# EasyEDA Pro project Backlit-PCB-Art-Lamp.epro

# Schematic Electrical Schematic

## Sheets
1 Power & Control: Create Date: 2026-09-15; Page Name: P1; Project Name: PCB Backlight Art Light; Schematic Name: Schematic1; Update Date: 2026-09-15; Company: Personal Project; Drawed: Junyi Wu; Page Size: A4; Version: 2.3
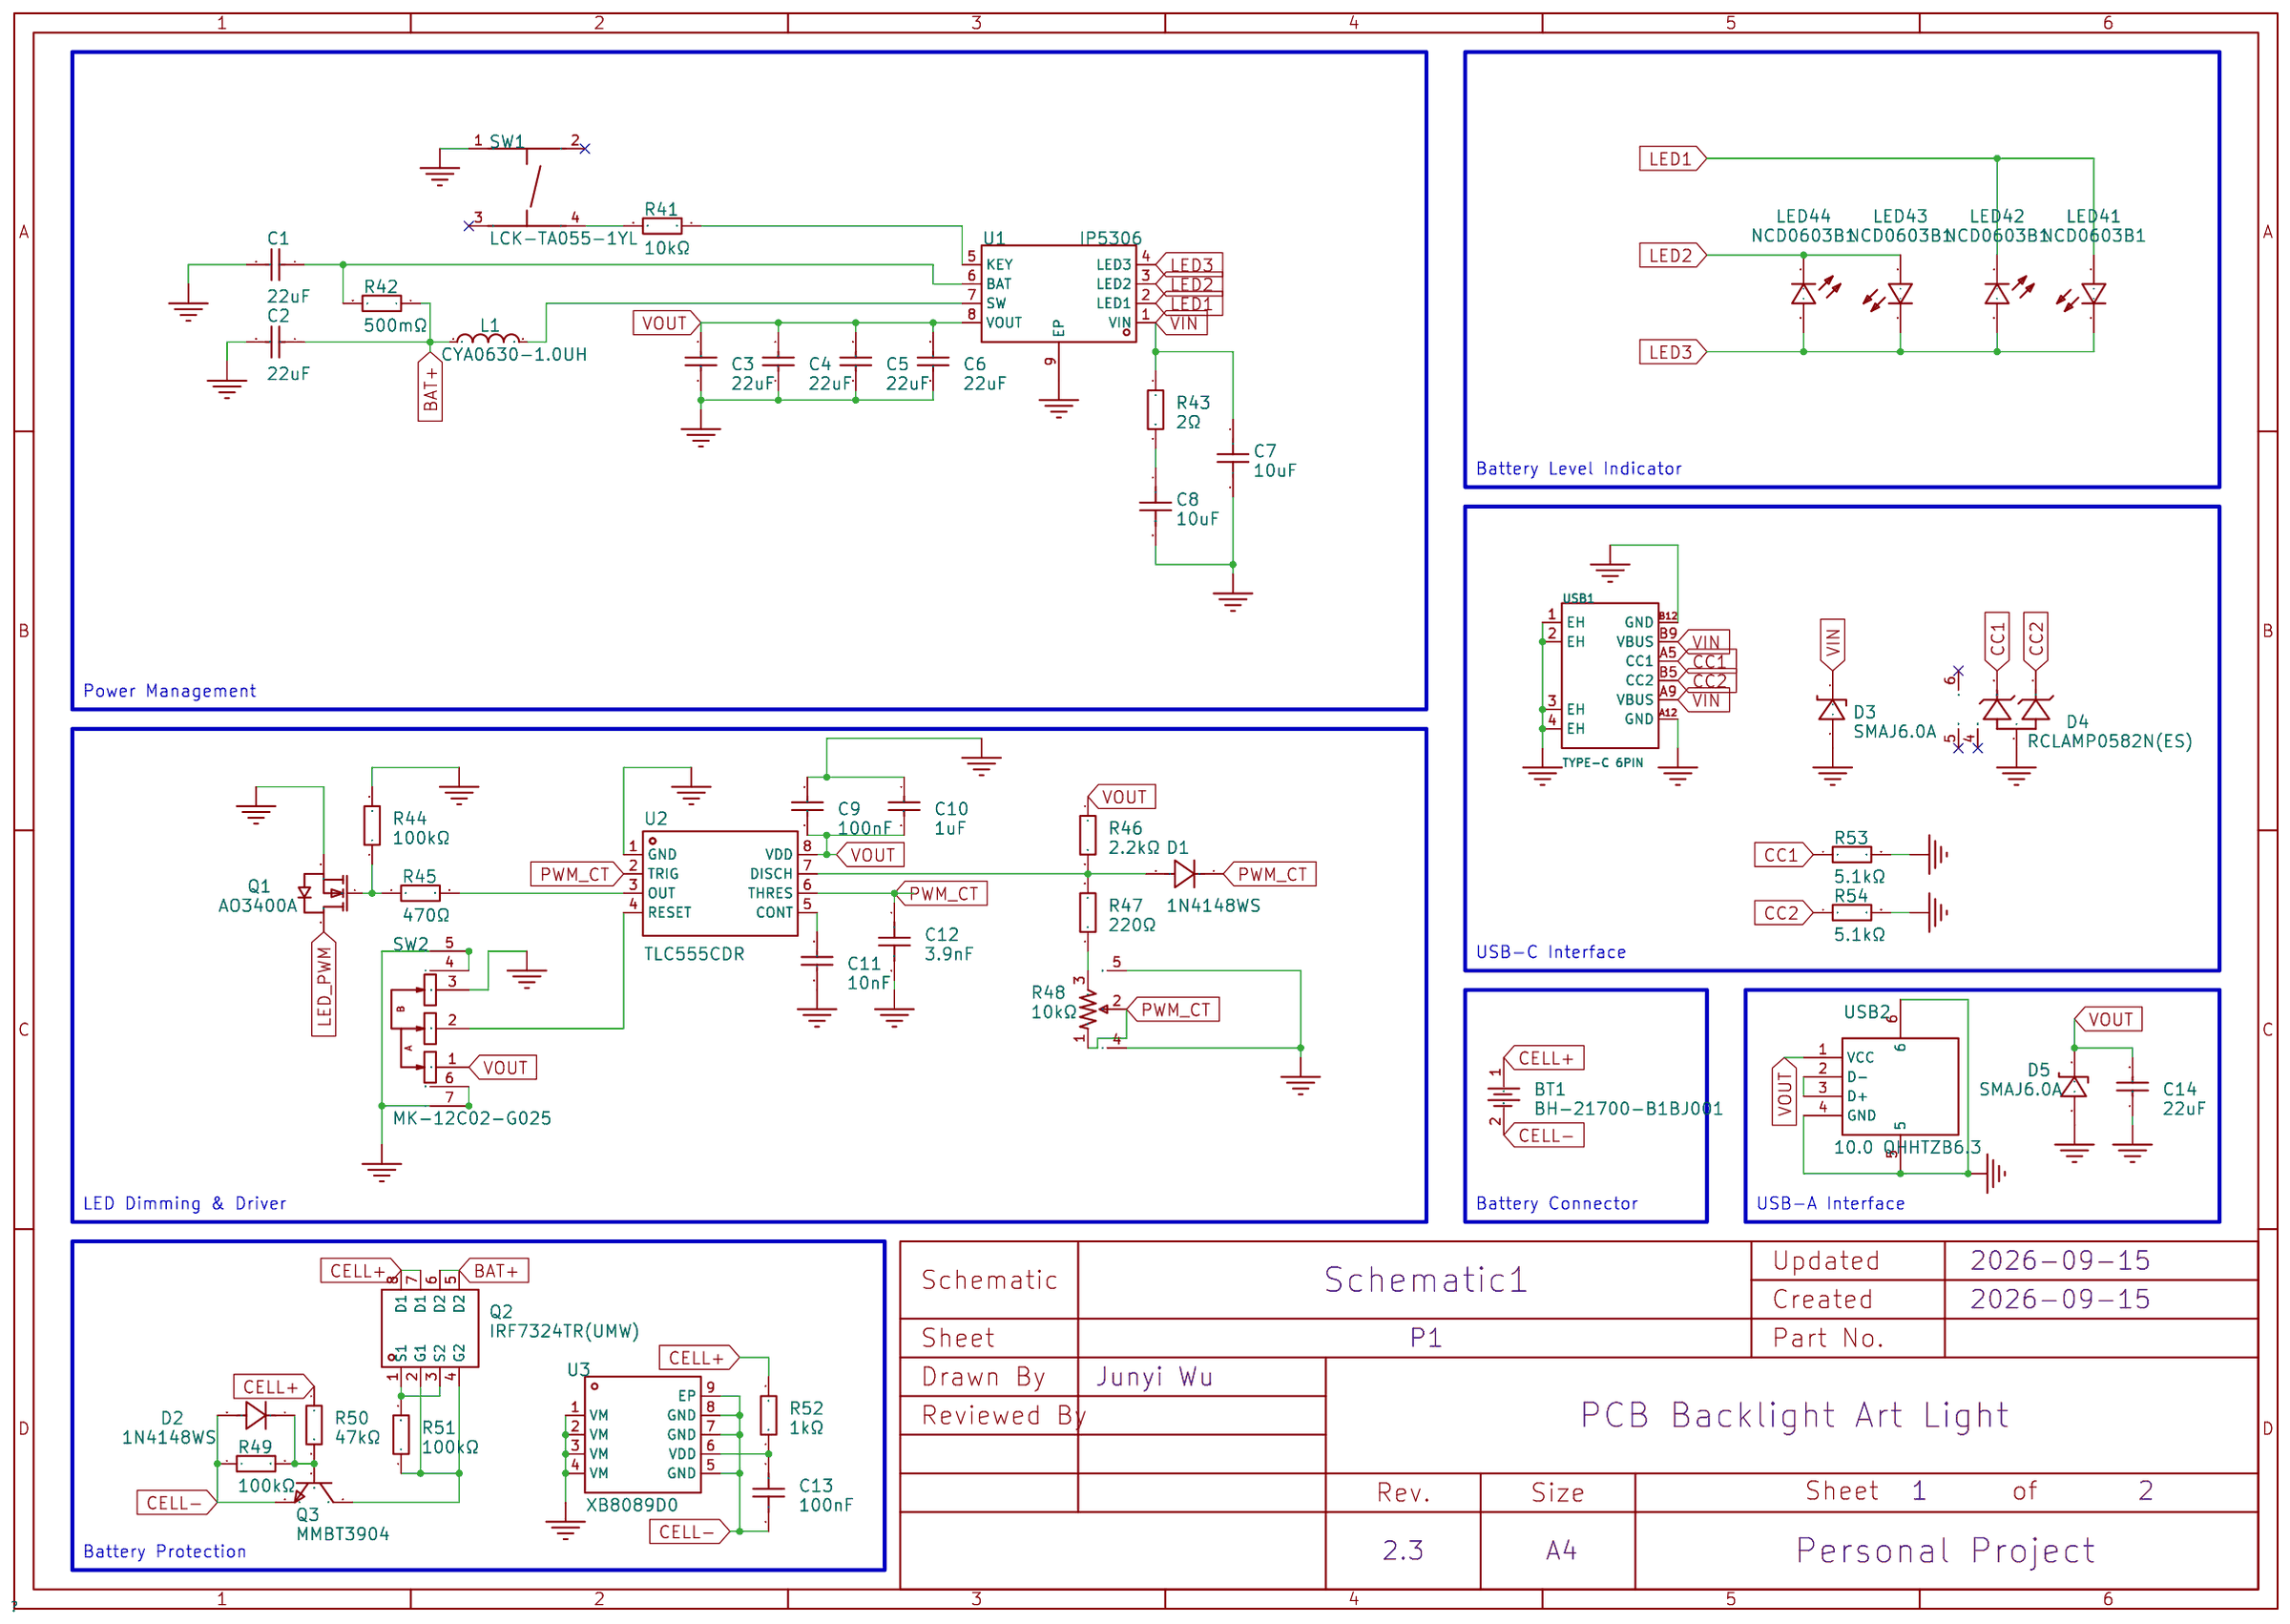
[diagram p0: Power & Control]
2 LED Array: Page Name: P2
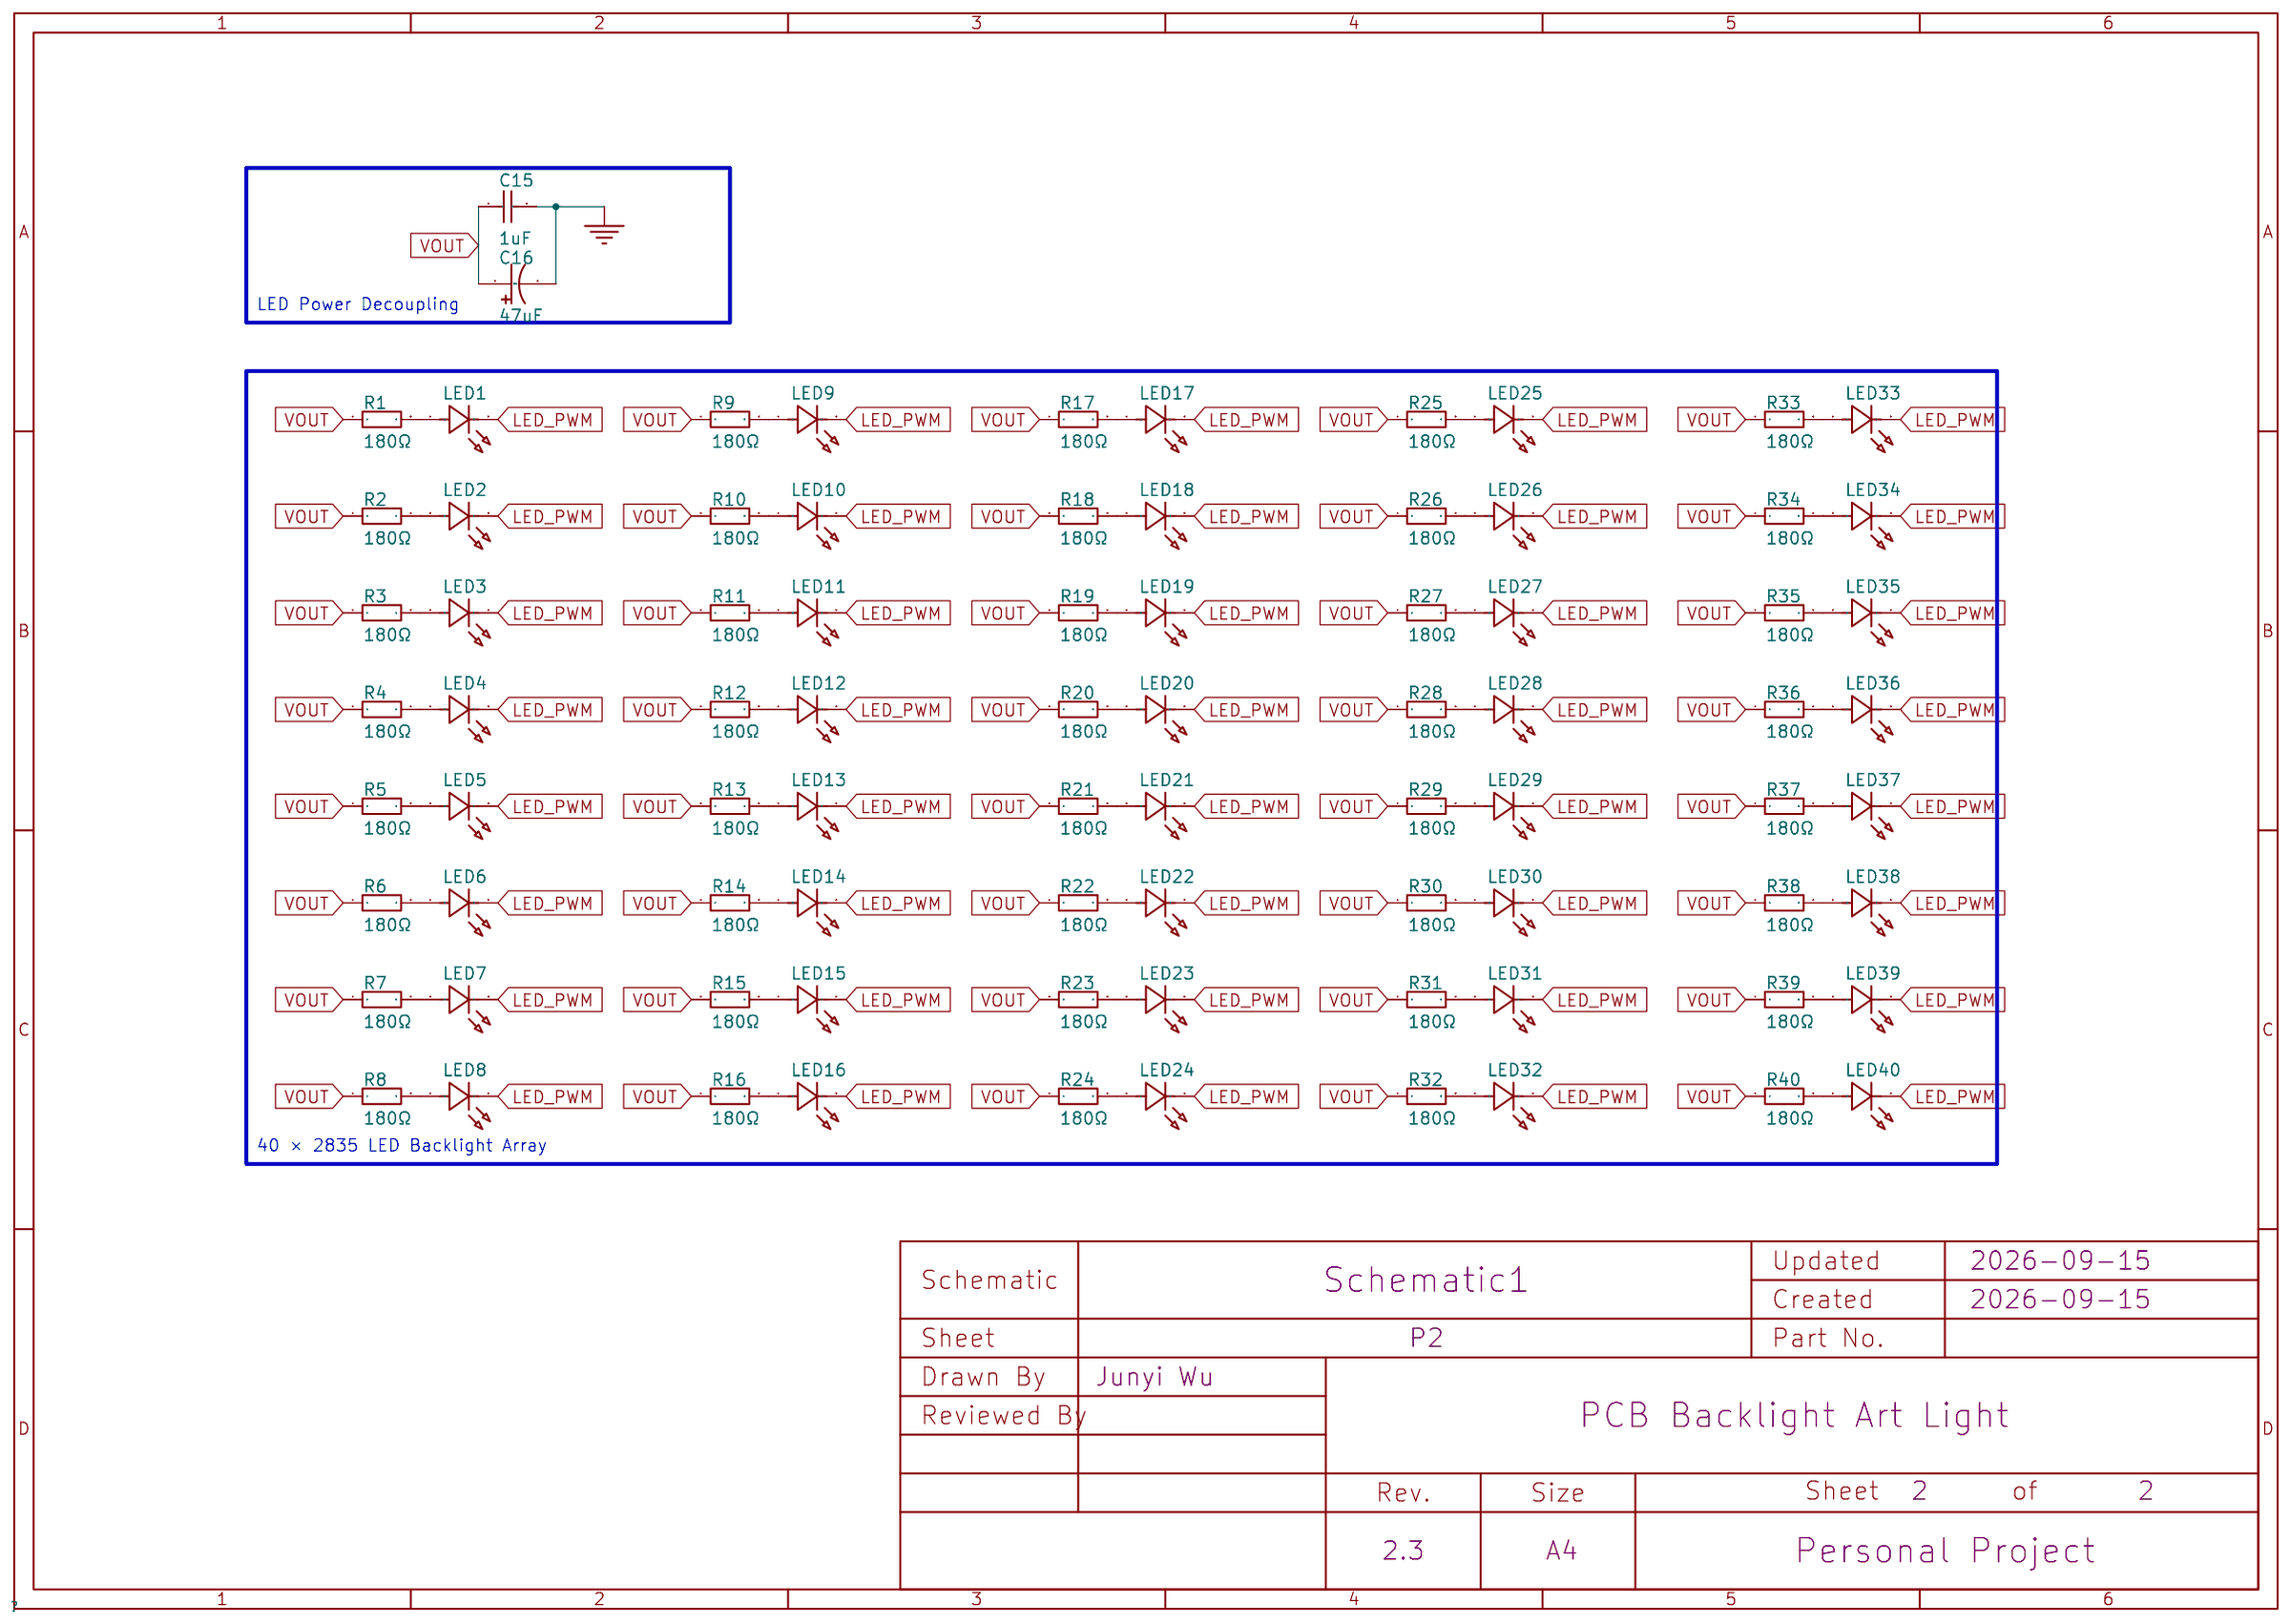
[diagram p1: LED Array]

## Parts
sheet LED Array
C15  1uF  [C0603]
C16  47uF  [CAP-SMD_BD5.0-L5.3-W5.3-LS6.5-FD-1]
LED1  -  [RCW_2835_LED_Custom]
LED2  -  [RCW_2835_LED_Custom]
LED3  -  [RCW_2835_LED_Custom]
LED4  -  [RCW_2835_LED_Custom]
LED5  -  [RCW_2835_LED_Custom]
LED6  -  [RCW_2835_LED_Custom]
LED7  -  [RCW_2835_LED_Custom]
LED8  -  [RCW_2835_LED_Custom]
LED9  -  [RCW_2835_LED_Custom]
LED10  -  [RCW_2835_LED_Custom]
LED11  -  [RCW_2835_LED_Custom]
LED12  -  [RCW_2835_LED_Custom]
LED13  -  [RCW_2835_LED_Custom]
LED14  -  [RCW_2835_LED_Custom]
LED15  -  [RCW_2835_LED_Custom]
LED16  -  [RCW_2835_LED_Custom]
LED17  -  [RCW_2835_LED_Custom]
LED18  -  [RCW_2835_LED_Custom]
LED19  -  [RCW_2835_LED_Custom]
LED20  -  [RCW_2835_LED_Custom]
LED21  -  [RCW_2835_LED_Custom]
LED22  -  [RCW_2835_LED_Custom]
LED23  -  [RCW_2835_LED_Custom]
LED24  -  [RCW_2835_LED_Custom]
LED25  -  [RCW_2835_LED_Custom]
LED26  -  [RCW_2835_LED_Custom]
LED27  -  [RCW_2835_LED_Custom]
LED28  -  [RCW_2835_LED_Custom]
LED29  -  [RCW_2835_LED_Custom]
LED30  -  [RCW_2835_LED_Custom]
LED31  -  [RCW_2835_LED_Custom]
LED32  -  [RCW_2835_LED_Custom]
LED33  -  [RCW_2835_LED_Custom]
LED34  -  [RCW_2835_LED_Custom]
LED35  -  [RCW_2835_LED_Custom]
LED36  -  [RCW_2835_LED_Custom]
LED37  -  [RCW_2835_LED_Custom]
LED38  -  [RCW_2835_LED_Custom]
LED39  -  [RCW_2835_LED_Custom]
LED40  -  [RCW_2835_LED_Custom]
R1  180Ω  [R0603]
R2  180Ω  [R0603]
R3  180Ω  [R0603]
R4  180Ω  [R0603]
R5  180Ω  [R0603]
R6  180Ω  [R0603]
R7  180Ω  [R0603]
R8  180Ω  [R0603]
R9  180Ω  [R0603]
R10  180Ω  [R0603]
R11  180Ω  [R0603]
R12  180Ω  [R0603]
R13  180Ω  [R0603]
R14  180Ω  [R0603]
R15  180Ω  [R0603]
R16  180Ω  [R0603]
R17  180Ω  [R0603]
R18  180Ω  [R0603]
R19  180Ω  [R0603]
R20  180Ω  [R0603]
R21  180Ω  [R0603]
R22  180Ω  [R0603]
R23  180Ω  [R0603]
R24  180Ω  [R0603]
R25  180Ω  [R0603]
R26  180Ω  [R0603]
R27  180Ω  [R0603]
R28  180Ω  [R0603]
R29  180Ω  [R0603]
R30  180Ω  [R0603]
R31  180Ω  [R0603]
R32  180Ω  [R0603]
R33  180Ω  [R0603]
R34  180Ω  [R0603]
R35  180Ω  [R0603]
R36  180Ω  [R0603]
R37  180Ω  [R0603]
R38  180Ω  [R0603]
R39  180Ω  [R0603]
R40  180Ω  [R0603]
sheet Power & Control
BT1  BH-21700-B1BJ001  [BAT-SMD_L82.5.5-W25-BH-21700-B1BJ001]
C1  22uF  [C1206]
C2  22uF  [C1206]
C3  22uF  [C1206]
C4  22uF  [C1206]
C5  22uF  [C1206]
C6  22uF  [C1206]
C7  10uF  [C0603]
C8  10uF  [C0603]
C9  100nF  [C0603]
C10  1uF  [C0603]
C11  10nF  [C0603]
C12  3.9nF  [C0603]
C13  100nF  [C0603]
C14  22uF  [C1206]
D1  1N4148WS  [SOD-323_L1.8-W1.3-LS2.5-RD]
D2  1N4148WS  [SOD-323_L1.8-W1.3-LS2.5-RD]
D3  SMAJ6.0A  [SMA_L4.3-W2.6-LS5.1-RD]
D4  RCLAMP0582N(ES)  [DFN1210-6_L1.2-W1.0-P0.40-BL]
D5  SMAJ6.0A  [SMA_L4.3-W2.6-LS5.1-RD]
L1  CYA0630-1.0UH  [IND-SMD_L7.2-W6.6_GPSR0730]
LED41  NCD0603B1  [LED0603-RD]
LED42  NCD0603B1  [LED0603-RD]
LED43  NCD0603B1  [LED0603-RD]
LED44  NCD0603B1  [LED0603-RD]
Q1  AO3400A  [SOT-23-3_L2.9-W1.3-P1.90-LS2.4-BR]
Q2  IRF7324TR(UMW)  [SOP-8_L4.9-W3.9-P1.27-LS6.0-BL]
Q3  MMBT3904  [SOT-23-3_L2.9-W1.3-P1.90-LS2.4-BR]
R41  10kΩ  [R0603]
R42  500mΩ  [R0603]
R43  2Ω  [R0603]
R44  100kΩ  [R0603]
R45  470Ω  [R0603]
R46  2.2kΩ  [R0603]
R47  220Ω  [R0603]
R48  10kΩ  [RISYM_B103_3Pin_Custom]
R49  100kΩ  [R0603]
R50  47kΩ  [R0603]
R51  100kΩ  [R0603]
R52  1kΩ  [R0603]
R53  5.1kΩ  [R0603]
R54  5.1kΩ  [R0603]
SW1  LCK-TA055-1YL  [KEY-SMD_4P-L4.7-W3.6_LCK-TA055-1YL]
SW2  MK-12C02-G025  [SW-SMD_MK-12C02-G025]
U1  IP5306  [ESOP-8_L4.9-W3.9-P1.27-LS6.0-BL-EP]
U2  TLC555CDR  [SOIC-8_L5.0-W4.0-P1.27-LS6.0-BL]
U3  XB8089D0  [SOIC-8_L4.9-W3.9-P1.27-LS6.0-BL-EP3.3-1]
USB1  TYPE-C 6PIN  [USB-SMD_TYPE-C-6PIN]
USB2  10.0 QHHTZB6.3  [USB-A-TH_10.0QHHTZB6.3]

## Library data of the parts
C10 C15 = CC0603KRX5R8BB105: 容值:1uF;精度:±10%;额定电压:25V;温度系数:X5R;; LCSC Part Name: 1uF ±10% 25V; Supplier Part: C14664; Manufacturer: YAGEO(国巨); Supplier Footprint: 0603; JLCPCB Part Class: Extended Part; Datasheet: https://item.szlcsc.com/datasheet/CC0603KRX5R8BB105/15332.html; Supplier: LCSC; Tolerance: ±10%; Voltage Rating: 25V; Temperature Coefficient: X5R
C16 = EEEFK1C470UR: 容值:47uF;精度:±20%;额定电压:16V;纹波电流:120mA@120Hz;等效串联电阻(ESR):-;; LCSC Part Name: 47uF ±20% 16V; Supplier Part: C178535; Manufacturer: PANASONIC(松下); Supplier Footprint: SMD; JLCPCB Part Class: Extended Part; Datasheet: https://item.szlcsc.com/datasheet/EEEFK1C470UR/189928.html; Supplier: LCSC; Tolerance: ±20%; Voltage Rating: 16V; Ripple Current: 120mA@120Hz; Lifetime: 2000hrs@105℃; Operating Temperature: -55℃~+105℃; Polarity type: 有极性
LED1-LED40 = RCW_2835_LED: 灯头类型:-;发光颜色:暖白色;正向压降(Vf):3.4V;功率:200mW;正向电流:60mA;波长:-;二极管配置:独立二极管;透镜颜色:雾状黄色透镜;色温:3000K~3200K;发光强度:-;发光角度:120°;载带方式:-;工作温度:-30℃~+85℃;; Manufacturer: RCW; Supplier Footprint: SMD2835; Illumination Color: 白色; Voltage - Forward(Vf): 3.4V; Power(Watts): 500mW; Forward Current: 150mA; Diode Configuration: 独立二极管; Color Temperature: 4500K; Operating Temperature: -30℃~+85℃
R1-R40 = 0603WAF1800T5E: 电阻类型:厚膜电阻;阻值:180Ω;精度:±1%;功率:100mW;最大工作电压:75V;温度系数:±100ppm/℃;; LCSC Part Name: 180Ω ±1% 100mW 厚膜电阻; Supplier Part: C22828; Manufacturer: UNI-ROYAL(厚声); Supplier Footprint: 0603; JLCPCB Part Class: Extended Part; Datasheet: https://atta.szlcsc.com/upload/public/pdf/source/20200306/C422600_1E6D84923E4A46A82E41ADD87F860B5C.pdf; Supplier: LCSC; Type: 厚膜电阻; Tolerance: ±1%; Power(Watts): 100mW; Overload Voltage (Max): 75V; Temperature Coefficient: ±100ppm/℃; Operating Temperature Range: -55℃~+155℃
BT1 = BH-21700-B1BJ001: 电池盒BHNi SMT 适用电池型号21700电池/电芯/ SMT贴片工艺 材质：锰钢  镀镍，; LCSC Part Name: MYOUNG(美阳)电池盒BH-21700-1J Ni SMT贴片工艺 适配21700电池; Supplier Part: C20606791; Manufacturer: MYOUNG(美阳); JLCPCB Part Class: Extended Part; Datasheet: https://item.szlcsc.com/datasheet/BH-21700-B1BJ001/21949508.html; Supplier: LCSC; Type: 电池盒; Operating Temperature: -25~85℃; Contact coating: 镀镍
C1-C6 C14 = CL31A226KAHNNNE: 容值:22uF;精度:±10%;额定电压:25V;温度系数:X5R;; LCSC Part Name: 22uF ±10% 25V; Supplier Part: C12891; Manufacturer: SAMSUNG(三星); Supplier Footprint: 1206; JLCPCB Part Class: 基础库; Datasheet: https://item.szlcsc.com/datasheet/CL31A226KAHNNNE/13537.html; Supplier: LCSC; Tolerance: ±10%; Voltage Rating: 25V; Temperature Coefficient: X5R
C7 C8 = CL10A106MA8NRNC: 容值:10uF;精度:±20%;额定电压:25V;温度系数:X5R;; LCSC Part Name: 10uF ±20% 25V; Supplier Part: C96446; Manufacturer: SAMSUNG(三星); Supplier Footprint: 0603; JLCPCB Part Class: Basic Part; Datasheet: https://item.szlcsc.com/datasheet/CL10A106MA8NRNC/97651.html; Supplier: LCSC; Tolerance: ±20%; Voltage Rating: 25V; Temperature Coefficient: X5R
C9 = CL10B104KO8NNNC: 容值:100nF;精度:±10%;额定电压:16V;温度系数:X7R;; LCSC Part Name: 100nF ±10% 16V; Supplier Part: C66501; Manufacturer: SAMSUNG(三星); Supplier Footprint: 0603; JLCPCB Part Class: Extended Part; Datasheet: https://item.szlcsc.com/datasheet/CL10B104KO8NNNC/67585.html; Supplier: LCSC; Tolerance: ±10%; Voltage Rating: 16V; Temperature Coefficient: X7R
C11 = CC0603JRX7R9BB103: 容值:10nF;精度:±5%;额定电压:50V;温度系数:X7R;; LCSC Part Name: 10nF ±5% 50V; Supplier Part: C115056; Manufacturer: YAGEO(国巨); Supplier Footprint: 0603; JLCPCB Part Class: Extended Part; Datasheet: https://item.szlcsc.com/datasheet/CC0603JRX7R9BB103/116301.html; Supplier: LCSC; Tolerance: ±5%; Voltage Rating: 50V; Temperature Coefficient: X7R
C12 = GRM1885C1H392JA01D: 容值:3.9nF;精度:±5%;额定电压:50V;温度系数:C0G;; LCSC Part Name: 3.9nF ±5% 50V; Supplier Part: C415537; Manufacturer: muRata(村田); Supplier Footprint: 0603; JLCPCB Part Class: Extended Part; Datasheet: https://item.szlcsc.com/datasheet/GRM1885C1H392JA01D/408031.html; Supplier: LCSC; Tolerance: ±5%; Voltage Rating: 50V; Temperature Coefficient: C0G
C13 = CC0603KRX7R9BB104: 容值:100nF;精度:±10%;额定电压:50V;温度系数:X7R;; LCSC Part Name: 100nF ±10% 50V; Supplier Part: C14663; Manufacturer: YAGEO(国巨); Supplier Footprint: 0603; JLCPCB Part Class: 基础库; Datasheet: https://item.szlcsc.com/datasheet/CC0603KRX7R9BB104/15331.html; Supplier: LCSC; Tolerance: ±10%; Voltage Rating: 50V; Temperature Coefficient: X7R
D1 D2 = 1N4148WS_C917117: 二极管配置:独立式;整流电流:200mA;直流反向耐压(Vr):75V;正向压降(Vf):1.25V@150mA;反向恢复时间(Trr):4ns;; LCSC Part Name: 75V 200mA; Supplier Part: C917117; Manufacturer: JSMSEMI(杰盛微); Supplier Footprint: SOD-323; JLCPCB Part Class: Extended Part; Datasheet: https://item.szlcsc.com/datasheet/1N4148WS/991613.html; Supplier: LCSC; Diode Configuration: 独立式; Pd - Power Dissipation: 200mW; Current - Rectified: 200mA; Voltage - DC Reverse(Vr): 75V; Voltage - Forward(Vf@If): 1.25V@150mA; Non-Repetitive Peak Forward Surge Current: 2A; Reverse Leakage Current (Ir): 1uA@75V; Reverse Recovery Time (trr): 4ns; Operating Junction Temperature Range: -55℃~+150℃
D3 D5 = SMAJ6.0A_C364284: 极性:单向;反向截止电压(Vrwm):6V;钳位电压:10.3V;峰值脉冲电流(Ipp):38.8A;峰值脉冲功率(Ppp):400W@10/1000us;击穿电压(VBR):7.37V;; LCSC Part Name: 单向TVS 6V截止 峰值脉冲电流：38.8A; Supplier Part: C364284; Manufacturer: MDD(辰达半导体); Supplier Footprint: DO-214AC(SMA); JLCPCB Part Class: Extended Part; Datasheet: https://item.szlcsc.com/datasheet/SMAJ6.0A/338596.html; Supplier: LCSC; Polarity: 单向; Reverse Stand-Off Voltage (Vrwm): 6V; Clamping Voltage: 10.3V; Peak Pulse Current (Ipp): 38.8A; Peak Pulse Power Dissipation (Ppp): 400W@10/1000us; Voltage - Breakdown: 7.37V; Reverse Leakage Current (Ir): 800uA; Number of Channels: 单路; Operating Temperature: -65℃~+150℃; level of protection: IEC 61000-4-2; Type: TVS
D4 = RCLAMP0582N(ES): 极性:单向;反向截止电压(Vrwm):5V;钳位电压:13V;峰值脉冲电流(Ipp):4A@8/20us;峰值脉冲功率(Ppp):60W@8/20us;击穿电压:6V;; LCSC Part Name: 极性：单向 2路保护 反向关断电压（典型值）:5V(Max) 击穿电压（最小值）:6V 箝位电压:8.5V 峰值脉冲电流:4.5A (8/20us) 极性:Unidirectional，电容Cj：0.6pF; Supplier Part: C46970803; Manufacturer: ElecSuper(静芯); Supplier Footprint: DFN1210-6L; JLCPCB Part Class: Extended Part; Datasheet: https://item.szlcsc.com/datasheet/RCLAMP0582N(ES)/49147983.html; Supplier: LCSC; Polarity: 单向; Reverse Stand-Off Voltage (Vrwm): 5V; Clamping Voltage: 13V; Peak Pulse Current (Ipp): 4A@8/20us; Peak Pulse Power Dissipation (Ppp): 60W@8/20us; Voltage - Breakdown: 6V; Reverse Leakage Current (Ir): 1uA; Number of Channels: 双路; Operating Temperature: -40℃~+125℃; level of protection: IEC 61000-4-2; Type: TVS; Junction Capacitance: 0.5pF
L1 = CYA0630-1.0UH: 大电流/屏蔽电感/一体成型电感; LCSC Part Name: 1uH ±20%; Supplier Part: C5189744; Manufacturer: SHOU HAN(首韩); Supplier Footprint: SMD,7.2x6.6mm; JLCPCB Part Class: Extended Part; Datasheet: https://item.szlcsc.com/datasheet/CYA0630-1.0UH/5869563.html; Supplier: LCSC
LED41-LED44 = NCD0603B1: 灯头类型:-;发光颜色:蓝色;正向压降(Vf):2.6V~3.6V;功率:72mW;测试电流:10mA;波长:463nm~475nm;二极管配置:独立二极管;透镜颜色:-;色温:-;发光强度:220mcd;发光角度:130°;载带方式:-;工作温度:-30℃~+85℃;; LCSC Part Name: 片式发光二极管; Supplier Part: C84266; Manufacturer: 国星光电; Supplier Footprint: 0603; JLCPCB Part Class: Extended Part; Datasheet: https://item.szlcsc.com/datasheet/NCD0603B1/85435.html; Supplier: LCSC; Illumination Color: 蓝色; Voltage - Forward(Vf): 2.6V~3.6V; Power(Watts): 72mW; Test Current: 10mA; Wavelength - Dominant: 463nm~475nm; Peak Wavelength: 465nm; Diode Configuration: 独立二极管; Luminous Intensity: 220mcd; Viewing Angle: 130°; Operating Temperature: -30℃~+85℃; Half wave width: 20nm
Q1 = AO3400A_C347475: 数量:1个N沟道;漏源电压(Vdss):30V;连续漏极电流(Id):5.8A;导通电阻(RDS(on)):17mΩ@10V;耗散功率(Pd):1.4W;阈值电压(Vgs(th)):1.1V;; LCSC Part Name: 1个N沟道 耐压:30V 电流:5.8A; Supplier Part: C347475; Manufacturer: UMW(友台半导体); Supplier Footprint: SOT-23; JLCPCB Part Class: Extended Part; Datasheet: https://item.szlcsc.com/datasheet/AO3400A/324135.html; Supplier: LCSC; Number: 1个N沟道; Drain to Source Voltage: 30V; Current - Continuous Drain(Id): 5.8A; RDS(on): 17mΩ@10V; Pd - Power Dissipation: 1.4W; Gate Threshold Voltage (Vgs(th)): 1.1V; Gate Charge(Qg): 9.7nC@4.5V; Input Capacitance(Ciss): 823pF; Reverse Transfer Capacitance (Crss@Vds): 77pF; Operating Temperature: -55℃~+150℃; Output Capacitance(Coss): 99pF
Q2 = IRF7324TR(UMW): 数量:2个P沟道;漏源电压(Vdss):20V;连续漏极电流(Id):9A;导通电阻(RDS(on)):18mΩ@4.5V;耗散功率(Pd):2W;阈值电压(Vgs(th)):1V;; LCSC Part Name: P沟道 耐压:20V 电流:9A; Supplier Part: C5447651; Manufacturer: UMW(友台半导体); Supplier Footprint: SOP-8; JLCPCB Part Class: Extended Part; Datasheet: https://item.szlcsc.com/datasheet/IRF7324TR(UMW)/6346569.html; Supplier: LCSC; Number: 2个P沟道; Drain to Source Voltage: 20V; Current - Continuous Drain(Id): 9A; RDS(on): 18mΩ@4.5V; Pd - Power Dissipation: 2W; Gate Threshold Voltage (Vgs(th)): 1V; Gate Charge(Qg): 42nC; Input Capacitance(Ciss): 2.94nF; Reverse Transfer Capacitance (Crss@Vds): 420pF; Operating Temperature: -55℃~+150℃; Type: P沟道; Output Capacitance(Coss): 630pF
Q3 = MMBT3904_C7420353: 晶体管类型:NPN;集电极电流(Ic):200mA;集射极击穿电压(Vceo):40V;耗散功率(Pd):200mW;直流电流增益(hFE):100;; LCSC Part Name: hFE:100-300，丝印:1AM NPN 电流:200mA 电压:40V; Supplier Part: C7420353; Manufacturer: R+O(宏嘉诚); Supplier Footprint: SOT-23; JLCPCB Part Class: Extended Part; Datasheet: https://item.szlcsc.com/datasheet/MMBT3904/8397175.html; Supplier: LCSC; type: NPN; Current - Collector(Ic): 200mA; Collector - Emitter Voltage VCEO: 40V; Pd - Power Dissipation: 200mW; DC Current Gain: 100; Transition frequency(fT): 300MHz; Current - Collector Cutoff: 100nA; Vce Saturation(VCE(sat)): 300mV; Operating Temperature: -55℃~+150℃; Emitter-Base Voltage(Vebo): 6V; Number: 1个NPN; Configuration: 独立式
R41 = 0603WAF1002T5E: 电阻类型:厚膜电阻;阻值:10kΩ;精度:±1%;功率:100mW;工作电压:75V;温度系数:±100ppm/℃;; LCSC Part Name: 厚膜电阻 10kΩ ±1% 100mW; Supplier Part: C25804; Manufacturer: UNI-ROYAL(厚声); Supplier Footprint: 0603; JLCPCB Part Class: 基础库; Datasheet: https://item.szlcsc.com/datasheet/0603WAF1002T5E/26547.html; Supplier: LCSC; Type: 厚膜电阻; Tolerance: ±1%; Power(Watts): 100mW; Voltage-Supply(Max): 75V; Temperature Coefficient: ±100ppm/℃; Operating Temperature: -55℃~+155℃
R42 = 0603WAF500LT5E: 电阻类型:厚膜电阻;阻值:500mΩ;精度:±1%;功率:100mW;工作电压:75V;温度系数:±800ppm/℃;; LCSC Part Name: 500mΩ ±1% 100mW 厚膜电阻; Supplier Part: C45312; Manufacturer: UNI-ROYAL(厚声); Supplier Footprint: 0603; JLCPCB Part Class: Extended Part; Datasheet: https://item.szlcsc.com/datasheet/0603WAF500LT5E/46314.html; Supplier: LCSC; Type: 厚膜电阻; Tolerance: ±1%; Power(Watts): 100mW; Voltage-Supply(Max): 75V; Temperature Coefficient: ±800ppm/℃; Operating Temperature: -55℃~+155℃
R43 = 0603WAF200KT5E: 电阻类型:厚膜电阻;阻值:2Ω;精度:±1%;功率:100mW;工作电压:75V;温度系数:±200ppm/℃;; LCSC Part Name: 2Ω ±1% 100mW 厚膜电阻; Supplier Part: C22977; Manufacturer: UNI-ROYAL(厚声); Supplier Footprint: 0603; JLCPCB Part Class: Basic Part; Datasheet: https://item.szlcsc.com/datasheet/0603WAF200KT5E/23704.html; Supplier: LCSC; Type: 厚膜电阻; Tolerance: ±1%; Power(Watts): 100mW; Voltage-Supply(Max): 75V; Temperature Coefficient: ±200ppm/℃; Operating Temperature: -55℃~+155℃
R44 R49 R51 = 0603WAF1003T5E: 电阻类型:厚膜电阻;阻值:100kΩ;精度:±1%;功率:100mW;工作电压:75V;温度系数:±100ppm/℃;; LCSC Part Name: 厚膜电阻 100kΩ ±1%; Supplier Part: C25803; Manufacturer: UNI-ROYAL(厚声); Supplier Footprint: 0603; JLCPCB Part Class: Basic Part; Datasheet: https://item.szlcsc.com/datasheet/0603WAF1003T5E/26546.html; Supplier: LCSC; Type: 厚膜电阻; Tolerance: ±1%; Power(Watts): 100mW; Voltage-Supply(Max): 75V; Temperature Coefficient: ±100ppm/℃; Operating Temperature: -55℃~+155℃
R45 = 0603WAF4700T5E: 电阻类型:厚膜电阻;阻值:470Ω;精度:±1%;功率:100mW;工作电压:75V;温度系数:±100ppm/℃;; LCSC Part Name: 厚膜电阻 470Ω ±1%; Supplier Part: C23179; Manufacturer: UNI-ROYAL(厚声); Supplier Footprint: 0603; JLCPCB Part Class: Basic Part; Datasheet: https://item.szlcsc.com/datasheet/0603WAF4700T5E/23906.html; Supplier: LCSC; Type: 厚膜电阻; Tolerance: ±1%; Power(Watts): 100mW; Voltage-Supply(Max): 75V; Temperature Coefficient: ±100ppm/℃; Operating Temperature: -55℃~+155℃
R46 = 0603WAF2201T5E: 电阻类型:厚膜电阻;阻值:2.2kΩ;精度:±1%;功率:100mW;工作电压:75V;温度系数:±100ppm/℃;; LCSC Part Name: 厚膜电阻 2.2kΩ ±1%; Supplier Part: C4190; Manufacturer: UNI-ROYAL(厚声); Supplier Footprint: 0603; JLCPCB Part Class: Basic Part; Datasheet: https://item.szlcsc.com/datasheet/0603WAF2201T5E/4597.html; Supplier: LCSC; Type: 厚膜电阻; Tolerance: ±1%; Power(Watts): 100mW; Voltage-Supply(Max): 75V; Temperature Coefficient: ±100ppm/℃; Operating Temperature: -55℃~+155℃
R47 = 0603WAF2200T5E: 电阻类型:厚膜电阻;阻值:220Ω;精度:±1%;功率:100mW;最大工作电压:75V;温度系数:±100ppm/℃;; LCSC Part Name: 220Ω ±1% 100mW 厚膜电阻; Supplier Part: C22962; Manufacturer: UNI-ROYAL(厚声); Supplier Footprint: 0603; JLCPCB Part Class: Basic Part; Datasheet: https://atta.szlcsc.com/upload/public/pdf/source/20200306/C422600_1E6D84923E4A46A82E41ADD87F860B5C.pdf; Supplier: LCSC; Type: 厚膜电阻; Tolerance: ±1%; Power(Watts): 100mW; Overload Voltage (Max): 75V; Temperature Coefficient: ±100ppm/℃; Operating Temperature Range: -55℃~+155℃
R48 = RISYM_B103_3Pin: 阻值:10kΩ;精度:±20%;功率:50mW;; LCSC Part Name: 可调电阻; Manufacturer: RISYM(维芯); Manufacturer Part: B103; Supplier Footprint: SMD; Tolerance: ±20%; Power(Watts): 50mW
R50 = 0603WAF4702T5E: 电阻类型:厚膜电阻;阻值:47kΩ;精度:±1%;功率:100mW;工作电压:75V;温度系数:±100ppm/℃;; LCSC Part Name: 厚膜电阻 47kΩ ±1%; Supplier Part: C25819; Manufacturer: UNI-ROYAL(厚声); Supplier Footprint: 0603; JLCPCB Part Class: Basic Part; Datasheet: https://item.szlcsc.com/datasheet/0603WAF4702T5E/26562.html; Supplier: LCSC; Type: 厚膜电阻; Tolerance: ±1%; Power(Watts): 100mW; Voltage-Supply(Max): 75V; Temperature Coefficient: ±100ppm/℃; Operating Temperature: -55℃~+155℃
R52 = 0603WAF1001T5E: 电阻类型:厚膜电阻;阻值:1kΩ;精度:±1%;功率:100mW;工作电压:75V;温度系数:±100ppm/℃;; LCSC Part Name: 1kΩ ±1% 100mW 厚膜电阻; Supplier Part: C21190; Manufacturer: UNI-ROYAL(厚声); Supplier Footprint: 0603; JLCPCB Part Class: Basic Part; Datasheet: https://item.szlcsc.com/datasheet/0603WAF1001T5E/21904.html; Supplier: LCSC; Type: 厚膜电阻; Tolerance: ±1%; Power(Watts): 100mW; Voltage-Supply(Max): 75V; Temperature Coefficient: ±100ppm/℃; Operating Temperature: -55℃~+155℃
R53 R54 = 0603WAF5101T5E: 电阻类型:厚膜电阻;阻值:5.1kΩ;精度:±1%;功率:100mW;工作电压:75V;温度系数:±100ppm/℃;; LCSC Part Name: 5.1kΩ ±1% 100mW 厚膜电阻; Supplier Part: C23186; Manufacturer: UNI-ROYAL(厚声); Supplier Footprint: 0603; JLCPCB Part Class: Basic Part; Datasheet: https://item.szlcsc.com/datasheet/0603WAF5101T5E/23913.html; Supplier: LCSC; Type: 厚膜电阻; Tolerance: ±1%; Power(Watts): 100mW; Voltage-Supply(Max): 75V; Temperature Coefficient: ±100ppm/℃; Operating Temperature: -55℃~+155℃
SW1 = LCK-TA055-1YL: 电路结构:单刀单掷-常开;按钮形状:矩形按钮;作用力:1.8N;安装方式:卧贴;开关长度:4.7mm;开关宽度:1.65mm;开关高度:4.55mm;带支架:不带支架;触点电流:50mA;额定电压:12V;带灯:无;工作寿命:10万次;; LCSC Part Name: 3.5*4.7 侧龟带柱260g; Supplier Part: C53184738; Manufacturer: LCKELEC(联晟欣); Supplier Footprint: SMD; JLCPCB Part Class: Extended Part; Datasheet: https://item.szlcsc.com/datasheet/LCK-TA055-1YL/56200364.html; Supplier: LCSC; Circuit: 单刀单掷-常开; Actuator Style: 矩形按钮; Operating Force: 1.8N; Mounting Type: 卧贴; Length: 4.7mm; Width: 1.65mm; Switch Height: 4.55mm; with Bracket: 不带支架; Contact Current: 50mA; Voltage Rating: 12V; Actuator/Cap Color: 黑色; With Lamp: 无; Termination Style: SMD接片; Life: 10万次; Operating Temperature: -20℃~+70℃
SW2 = MK-12C02-G025: 电路结构:单刀双掷;安装方式:卧贴;开关颜色:黑色;额定电流:-;额定电压:-;工作寿命:-;; LCSC Part Name: 七脚小拨动开关2.5柄; Supplier Part: C778186; Manufacturer: G-Switch(品赞); Supplier Footprint: SMD,6.6x1.4mm; JLCPCB Part Class: Extended Part; Datasheet: https://item.szlcsc.com/datasheet/MK-12C02-G025/826787.html; Supplier: LCSC; Circuit: 单刀双掷; Actuator Style: 矩形柱状; Length: 6.6mm; Width: 1.4mm; Switch Height: 5.2mm; Mounting Type: 卧贴; Actuator Color: 黑色
U1 = IP5306: 工作电压:4.65V~5.5V;最大充电电流:2.1A;电池类型:锂电池;电池节数:1;; LCSC Part Name: 集成2.1A充电器和2.1A放电器的全集成移动电源系统级芯片; Supplier Part: C181692; Manufacturer: INJOINIC(英集芯); Supplier Footprint: ESOP-8; JLCPCB Part Class: 扩展库; Datasheet: https://item.szlcsc.com/datasheet/IP5306/193089.html; Supplier: LCSC; The Chip Type: 充电芯片；保护芯片; Voltage - Supply: 4.65V~5.5V; Charge Current - Max: 2.1A; Charging Saturation Voltage: 4.2V; End-Off Voltage: 3V; Type of Battery: 锂电池; Number of Cells: 1; Operating Temperature: 0℃~+70℃; Battery Temperature Detection: 不支持; 0V Battery Charge: 不支持; Supply Current (Iq): 100uA; Interface: I2C; Features: 过放保护；恒流充电；自动再充电；充电终止；短路保护；过压保护；过充保护；涓流充电；过流保护；欠压锁定
U2 = TLC555CDR: TLC555 2.1MHz、250μA、低功耗计时器; LCSC Part Name: 单片计时电路; Supplier Part: C6986; Manufacturer: TI(德州仪器); Supplier Footprint: SOIC-8; JLCPCB Part Class: Extended Part; Datasheet: https://www.ti.com/cn/lit/gpn/tlc555; Supplier: LCSC; Timer Number: 1; Voltage - Supply: 2V~15V; Supply Current: 170uA; Operating Temperature: 0℃~+70℃; Features: 复位功能
U3 = XB8089D0: 工作电压:2.9V~6V;最大充电电流:-;电池类型:锂电池;电池节数:1;; LCSC Part Name: 单节锂离子/聚合物电池保护IC; Supplier Part: C2760005; Manufacturer: xysemi(赛芯微); Supplier Footprint: SOP-8-EP; JLCPCB Part Class: Extended Part; Datasheet: https://item.szlcsc.com/datasheet/XB8089D0/2880106.html; Supplier: LCSC; The Chip Type: 保护芯片; Voltage - Supply: 2.9V~6V; Charging Saturation Voltage: 4.25V; End-Off Voltage: 2.9V; Type of Battery: 锂电池; Number of Cells: 1; Operating Temperature: -40℃~+85℃; Battery Temperature Detection: 不支持; 0V Battery Charge: 支持; Supply Current (Iq): 3uA; Features: 过流保护；过充保护；过放保护；短路保护
USB1 = TYPE-C 6PIN: 连接器类型:Type-C;协议标准:USB 3.1;公母:母;安装方式:卧贴;触点数量:6P;端口数量:1;额定电流 - 电源:3A;工作温度:-25℃~+85℃;; LCSC Part Name: 6P卧贴母座; Supplier Part: C7507406; Manufacturer: SHOU HAN(首韩); Supplier Footprint: SMD; JLCPCB Part Class: Extended Part; Datasheet: https://item.szlcsc.com/datasheet/TYPE-C%25206PIN/8598428.html; Supplier: LCSC; Connector Type: Type-C; Protocol Standard: USB 3.1; Gender: 母; Mounting Type: 卧贴; Number of Contacts: 6P; Number of Ports: 1; Current Rating-Power: 3A; Voltage Rating: 5V; Connect-Disconnect Life: 1万次; Detection color: 黑色; Operating Temperature: -25℃~+85℃
USB2 = 10.0 QHHTZB6.3: 连接器类型:Type-A;协议标准:USB 2.0;公母:母;安装方式:卧贴;触点数量:4P;端口数量:1;额定电流 - 电源:1.5A;工作温度:-25℃~+85℃;; LCSC Part Name: 壳长10.0mm; Supplier Part: C668591; Manufacturer: SHOU HAN(首韩); Supplier Footprint: SMD; JLCPCB Part Class: Extended Part; Datasheet: https://item.szlcsc.com/datasheet/10.0%2520QHHTZB6.3/698534.html; Supplier: LCSC; Connector Type: Type-A; Protocol Standard: USB 2.0; Gender: 母; Mounting Type: 卧贴; Number of Contacts: 4P; Number of Ports: 1; Current Rating-Power: 1.5A; Voltage Rating: 30V; Connect-Disconnect Life: 5千次; Length: 10mm; Detection color: 黑色; Operating Temperature: -25℃~+85℃

## Nets
GND: C1.2 C2.2 C3.1 C4.1 C5.1 C6.1 C7.2 C8.2 C9.2 C10.1 C11.2 C12.2 C14.1 C15.2 C16.2 D3.2(A) D4.3(A) D5.2(A) Q1.2(S) R44.2 R48.4 R48.5 R53.2 R54.2 SW1.1 SW2.3 SW2.4 SW2.5 SW2.6 SW2.7 U1.9(EP) U2.1(GND) U3.1(VM) U3.2(VM) U3.3(VM) U3.4(VM) USB1.1(EH) USB1.2(EH) USB1.3(EH) USB1.4(EH) USB1.A12(GND) USB1.B12(GND) USB2.4(GND) USB2.5 USB2.6
VIN: C7.1 D3.1(K) R43.1 U1.1(VIN) USB1.A9(VBUS) USB1.B9(VBUS)
BAT+: C2.1 L1.1 Q2.5(D2) Q2.6(D2) R42.1
CC1: D4.2(C) R53.1 USB1.A5(CC1)
CC2: D4.1(C) R54.1 USB1.B5(CC2)
CELL+: BT1.1 Q2.7(D1) Q2.8(D1) R50.1 R52.2
CELL-: BT1.2 C13.2 D2.2(A) Q3.2(E) R49.1 U3.5(GND) U3.7(GND) U3.8(GND) U3.9(EP)
LED1: LED41.2(+) LED42.1(-) U1.2(LED1)
LED2: LED43.2(+) LED44.1(-) U1.3(LED2)
LED3: LED41.1(-) LED42.2(+) LED43.1(-) LED44.2(+) U1.4(LED3)
LED_PWM: LED1.2(K) LED2.2(K) LED3.2(K) LED4.2(K) LED5.2(K) LED6.2(K) LED7.2(K) LED8.2(K) LED9.2(K) LED10.2(K) LED11.2(K) LED12.2(K) LED13.2(K) LED14.2(K) LED15.2(K) LED16.2(K) LED17.2(K) LED18.2(K) LED19.2(K) LED20.2(K) LED21.2(K) LED22.2(K) LED23.2(K) LED24.2(K) LED25.2(K) LED26.2(K) LED27.2(K) LED28.2(K) LED29.2(K) LED30.2(K) LED31.2(K) LED32.2(K) LED33.2(K) LED34.2(K) LED35.2(K) LED36.2(K) LED37.2(K) LED38.2(K) LED39.2(K) LED40.2(K) Q1.3(D)
PWM_CT: C12.1 D1.1(C) R48.1 R48.2 U2.2(TRIG) U2.6(THRES)
VOUT: C3.2 C4.2 C5.2 C6.2 C9.1 C10.2 C14.2 C15.1 C16.1 D5.1(K) R1.1 R2.1 R3.1 R4.1 R5.1 R6.1 R7.1 R8.1 R9.1 R10.1 R11.1 R12.1 R13.1 R14.1 R15.1 R16.1 R17.1 R18.1 R19.1 R20.1 R21.1 R22.1 R23.1 R24.1 R25.1 R26.1 R27.1 R28.1 R29.1 R30.1 R31.1 R32.1 R33.1 R34.1 R35.1 R36.1 R37.1 R38.1 R39.1 R40.1 R46.1 SW2.1 U1.8(VOUT) U2.8(VDD) USB2.1(VCC)
$1N266: Q1.1(G) R44.1 R45.1
$1N267: R45.2 U2.3(OUT)
$1N268: SW2.2 U2.4(RESET)
$1N269: C11.1 U2.5(CONT)
$1N271: D1.2(A) R46.2 R47.2 U2.7(DISCH)
$1N327: R41.2 SW1.4
$1N347: C13.1 R52.1 U3.6(VDD)
$1N352: L1.2 U1.7(SW)
$1N382: C8.1 R43.2
$1N396: Q2.1(S1) Q2.3(S2) R51.2
$1N397: Q2.2(G1) Q2.4(G2) Q3.3(C) R51.1
$1N402: D2.1(C) Q3.1(B) R49.2 R50.2
$1N415: R41.1 U1.5(KEY)
$1N424: C1.1 R42.2 U1.6(BAT)
$1N445: R47.1 R48.3
$1N449: USB2.2(D-) USB2.3(D+)
$2N433: LED1.1(A) R1.2
$2N435: LED2.1(A) R2.2
$2N437: LED3.1(A) R3.2
$2N439: LED4.1(A) R4.2
$2N441: LED5.1(A) R5.2
$2N443: LED6.1(A) R6.2
$2N445: LED7.1(A) R7.2
$2N447: LED8.1(A) R8.2
$2N449: LED9.1(A) R9.2
$2N451: LED10.1(A) R10.2
$2N453: LED11.1(A) R11.2
$2N455: LED12.1(A) R12.2
$2N457: LED13.1(A) R13.2
$2N459: LED14.1(A) R14.2
$2N461: LED15.1(A) R15.2
$2N463: LED16.1(A) R16.2
$2N465: LED17.1(A) R17.2
$2N467: LED18.1(A) R18.2
$2N469: LED19.1(A) R19.2
$2N471: LED20.1(A) R20.2
$2N473: LED21.1(A) R21.2
$2N475: LED22.1(A) R22.2
$2N477: LED23.1(A) R23.2
$2N479: LED24.1(A) R24.2
$2N481: LED25.1(A) R25.2
$2N483: LED26.1(A) R26.2
$2N485: LED27.1(A) R27.2
$2N487: LED28.1(A) R28.2
$2N489: LED29.1(A) R29.2
$2N491: LED30.1(A) R30.2
$2N493: LED31.1(A) R31.2
$2N495: LED32.1(A) R32.2
$2N497: LED33.1(A) R33.2
$2N499: LED34.1(A) R34.2
$2N501: LED35.1(A) R35.2
$2N503: LED36.1(A) R36.2
$2N505: LED37.1(A) R37.2
$2N507: LED38.1(A) R38.2
$2N509: LED39.1(A) R39.2
$2N511: LED40.1(A) R40.2

Not connected (* = marked no-connect by the designer): D4 4(NC)* 5(NC)* 6(NC)*; SW1 2* 3*

## Notes on the sheets
sheet 1
- Battery Level Indicator
- Power Management
- USB-C Interface
- LED Dimming & Driver
- Battery Connector
- USB-A Interface
- Battery Protection
sheet 2
- LED Power Decoupling
- 40 × 2835 LED Backlight Array

# Board Art PCB
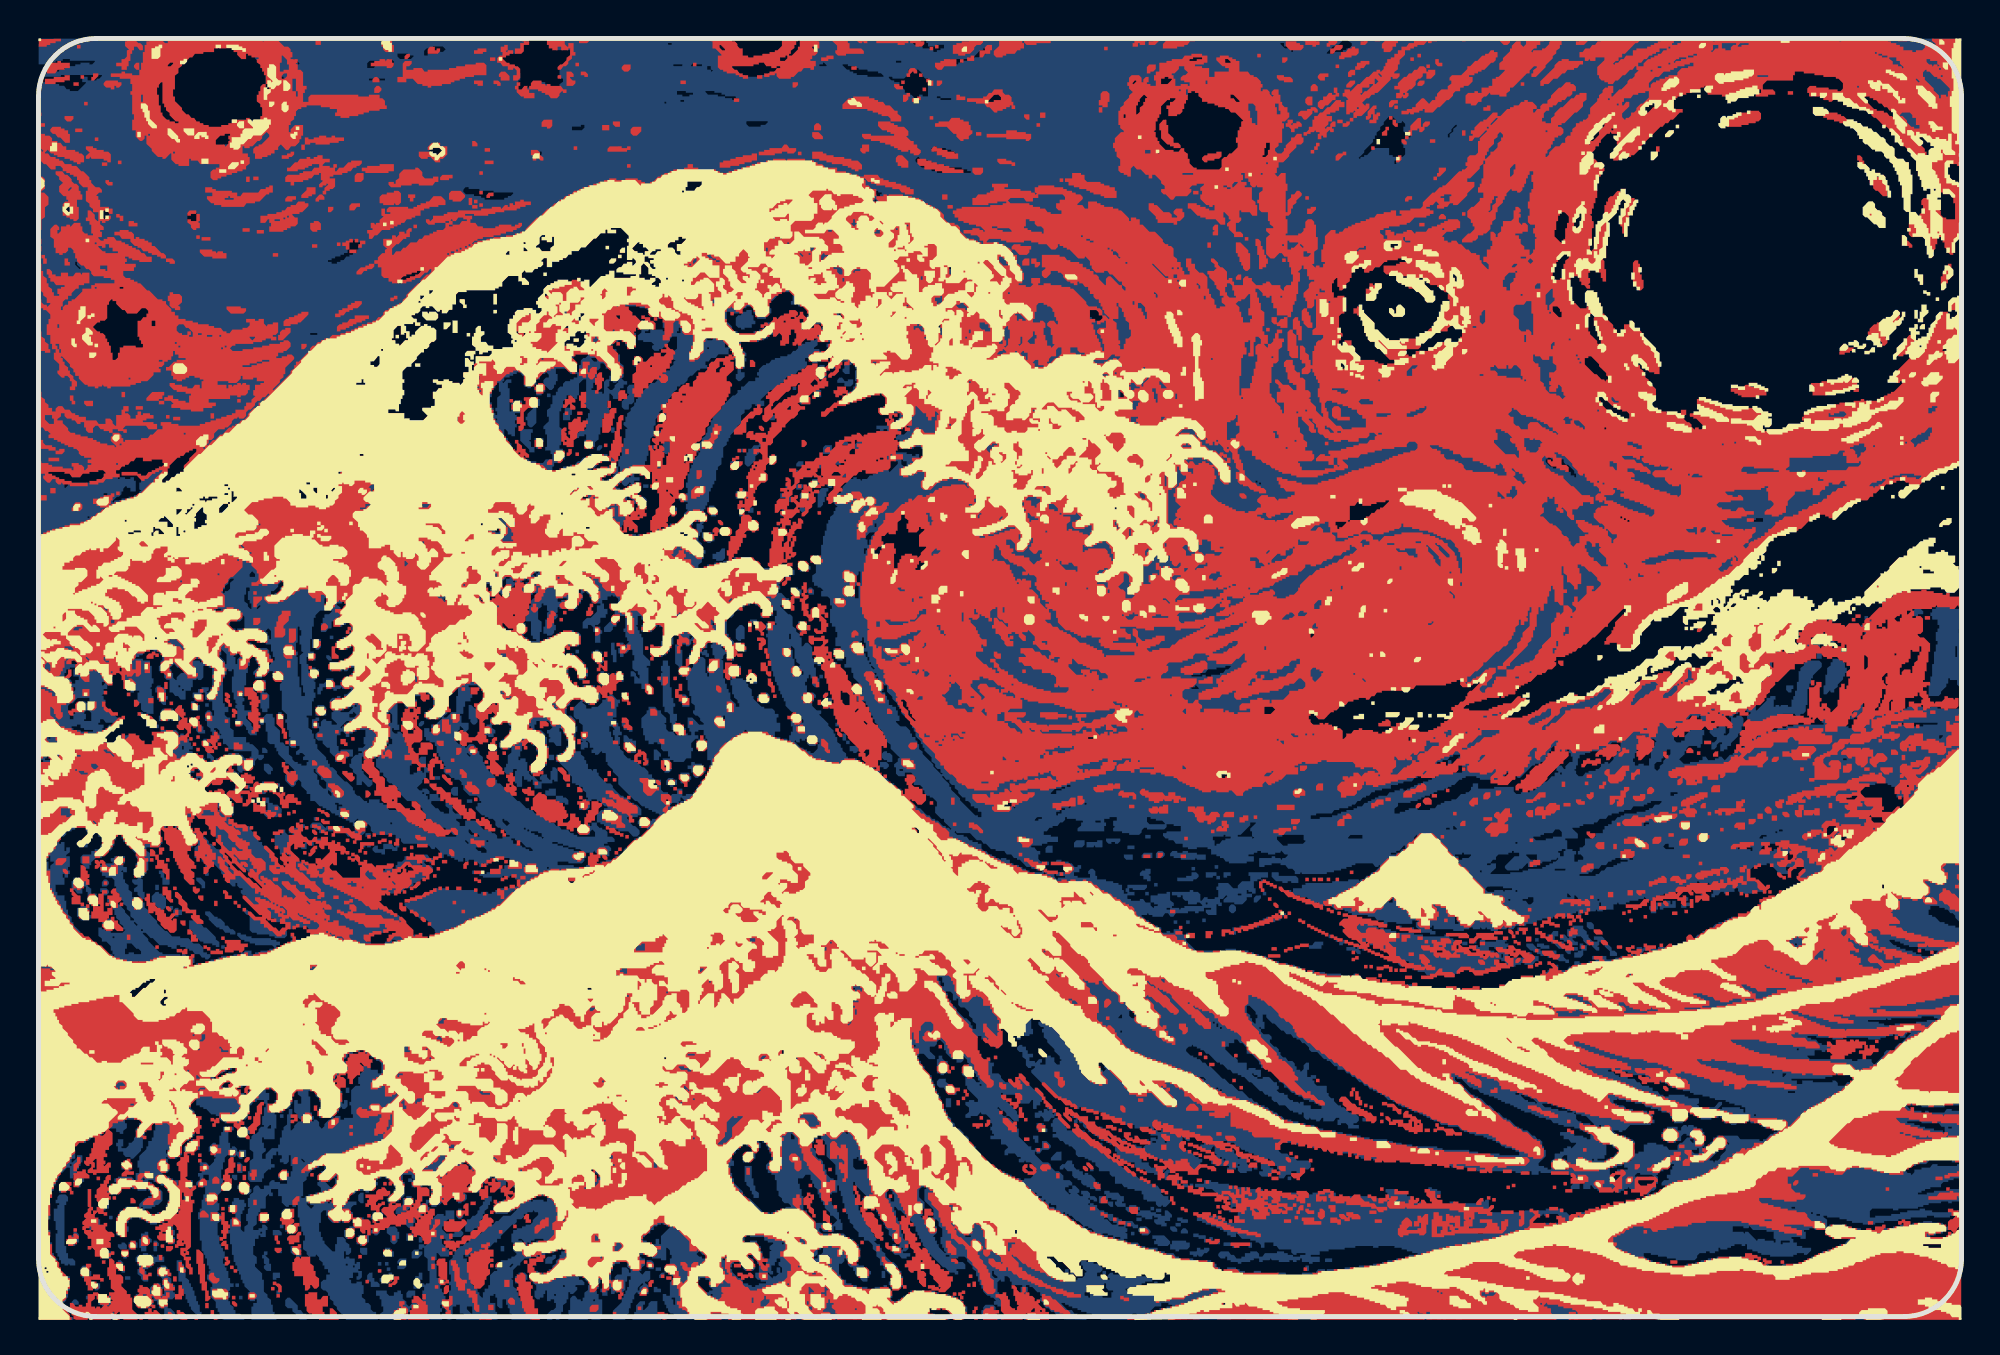
[diagram p2: board, top side]
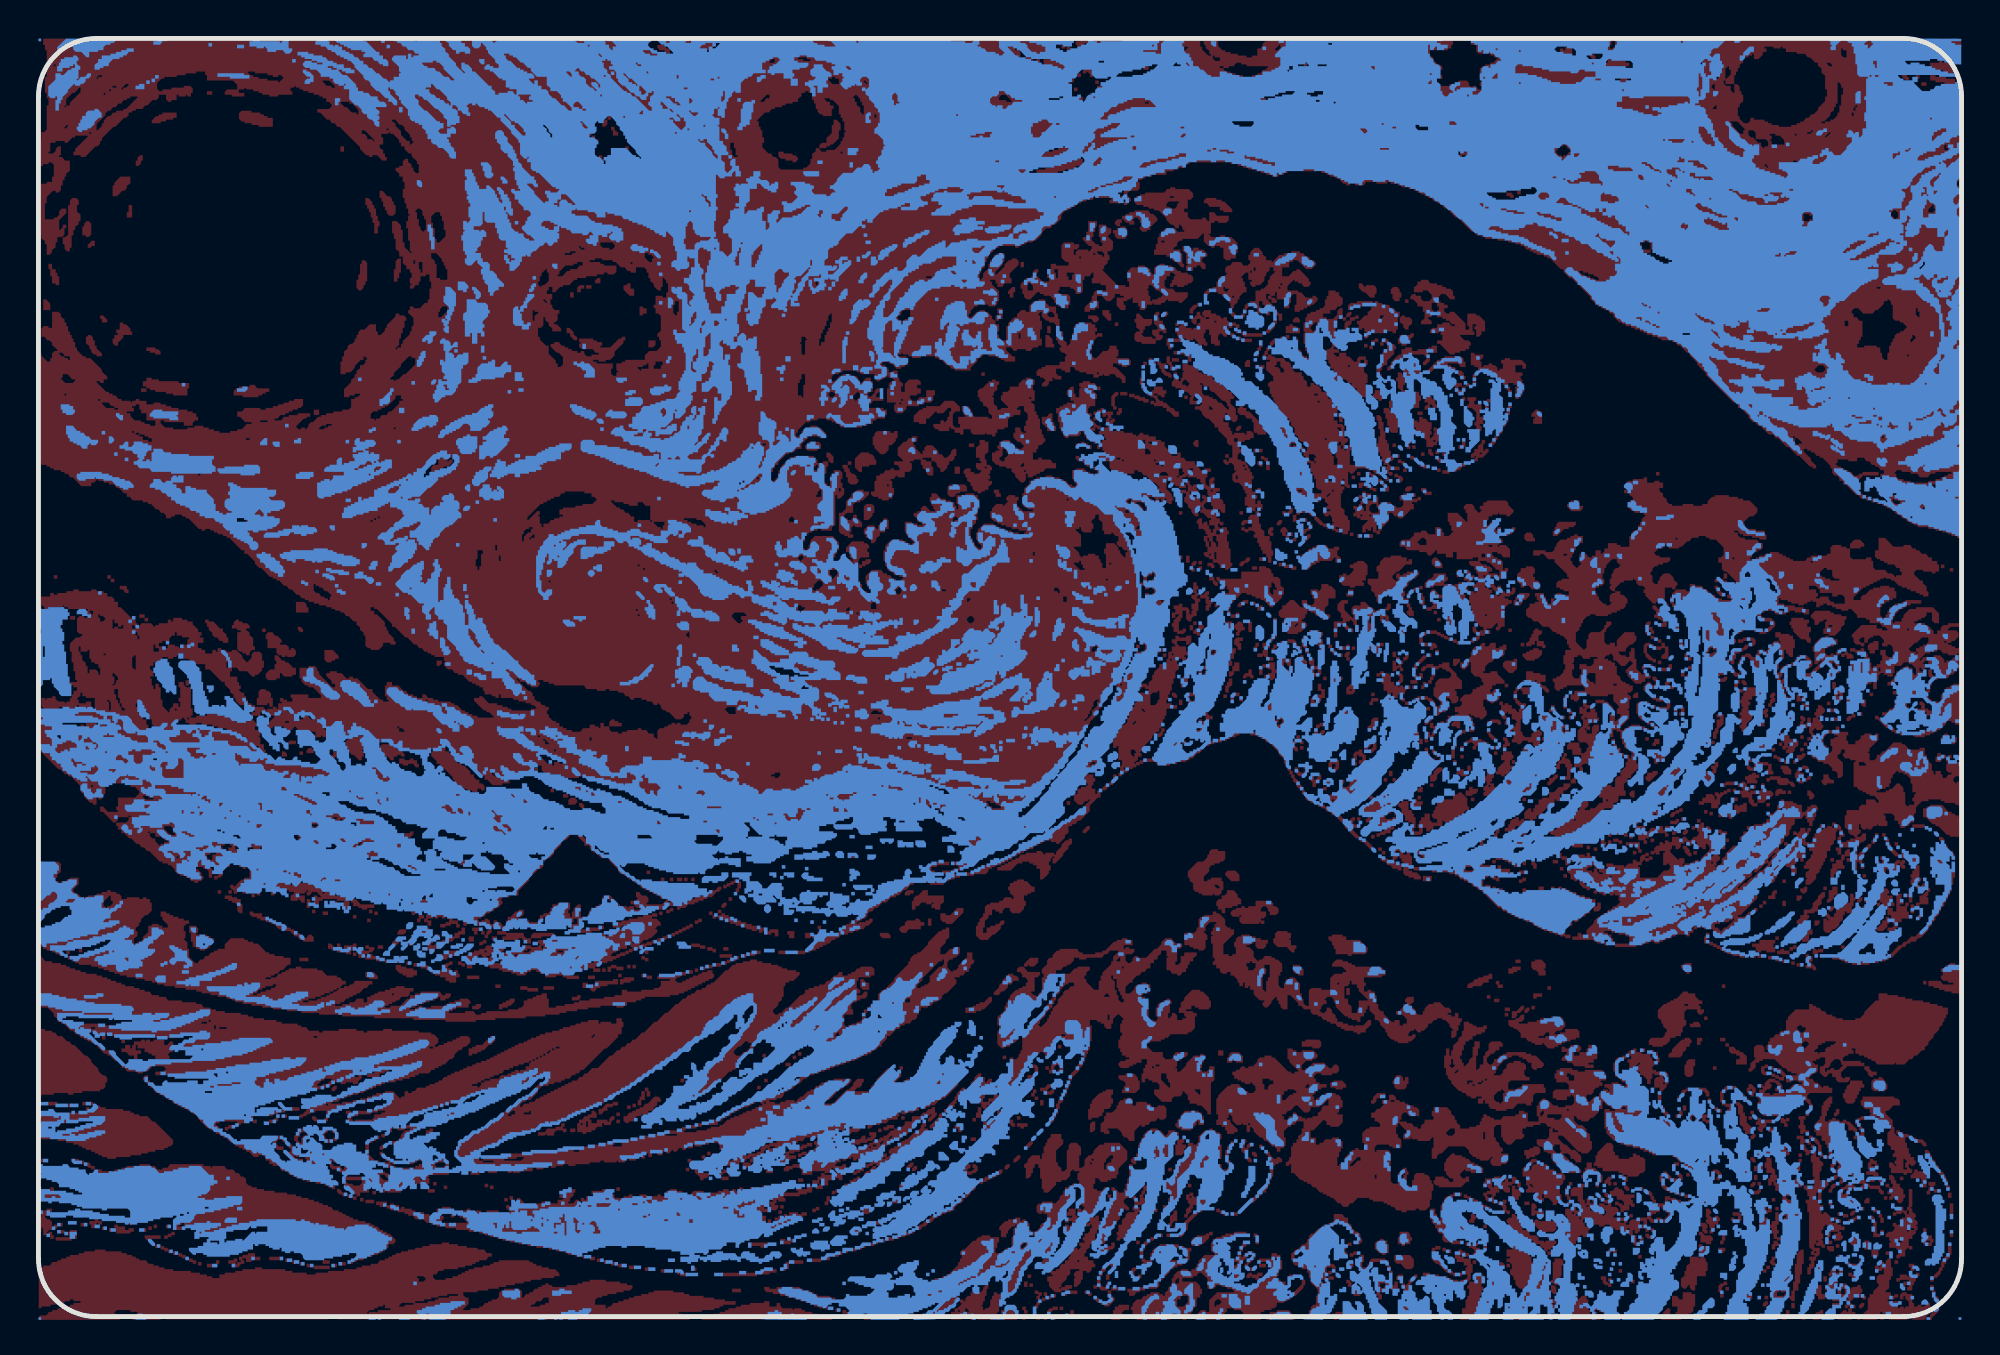
[diagram p3: board, bottom side, seen from below]

Outline 100 x 66.5 mm; copper layers: Top Layer, Bottom Layer. Coordinates in mm from the lower left corner of the outline.
Outline path: 0,63.5 0,3 arc(0.88,0.88) 3,0 97,0 arc(99.12,0.88) 100,3 100,63.5 arc(99.12,65.62) 97,66.5 3,66.5 arc(0.88,65.62) 0,63.5
Stack: Top Layer 0.035mm / Dielectric1 1.51mm FR4 er 4.5 / Bottom Layer 0.035mm

## Design rules (mm)
spacing copperThickness1oz (default): track to track 0.102, other pairs 0.152 to 0.3
spacing copperThickness2oz: track to track 0.203, other pairs 0.152 to 0.3
track width copperThickness1oz (default): min 0.127, default 0.254, max 2.54
track width copperThickness2oz: min 0.203, default 0.254, max 2.54
differential pair differentialPair (default): width min 0.127, default 0.254, max 2.54; gap min 0.152, default 0.152

## Placement (name value [footprint] x y rotation side)

## Nets

Small or netless copper shapes (teardrops, artwork), in the pictures only: 2385 on Top Layer, 1921 on Bottom Layer

# Board Main PCB
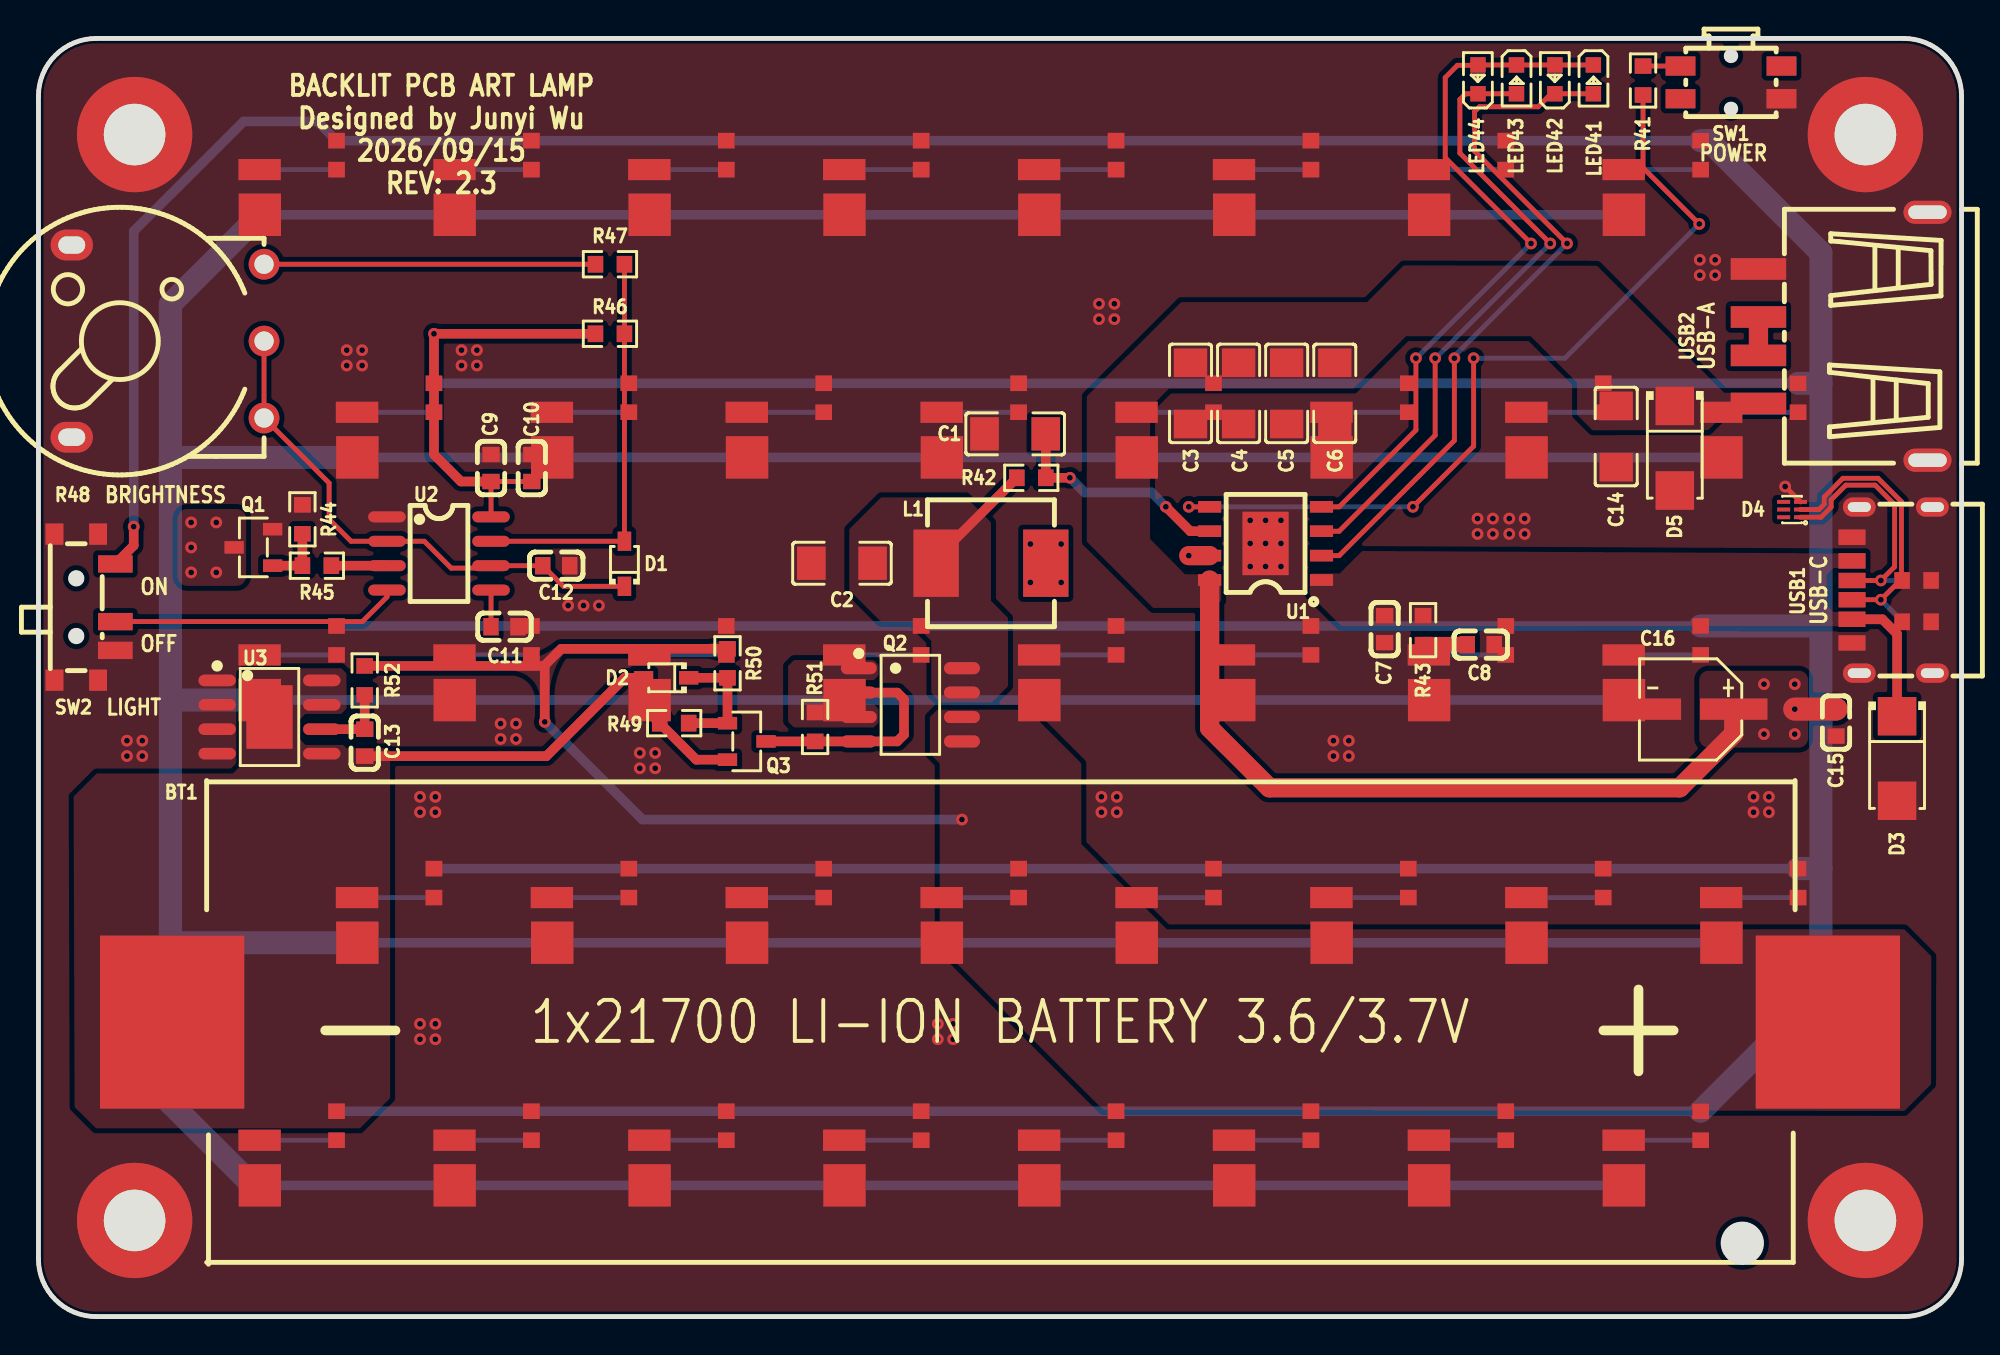
[diagram p4: board, top side]
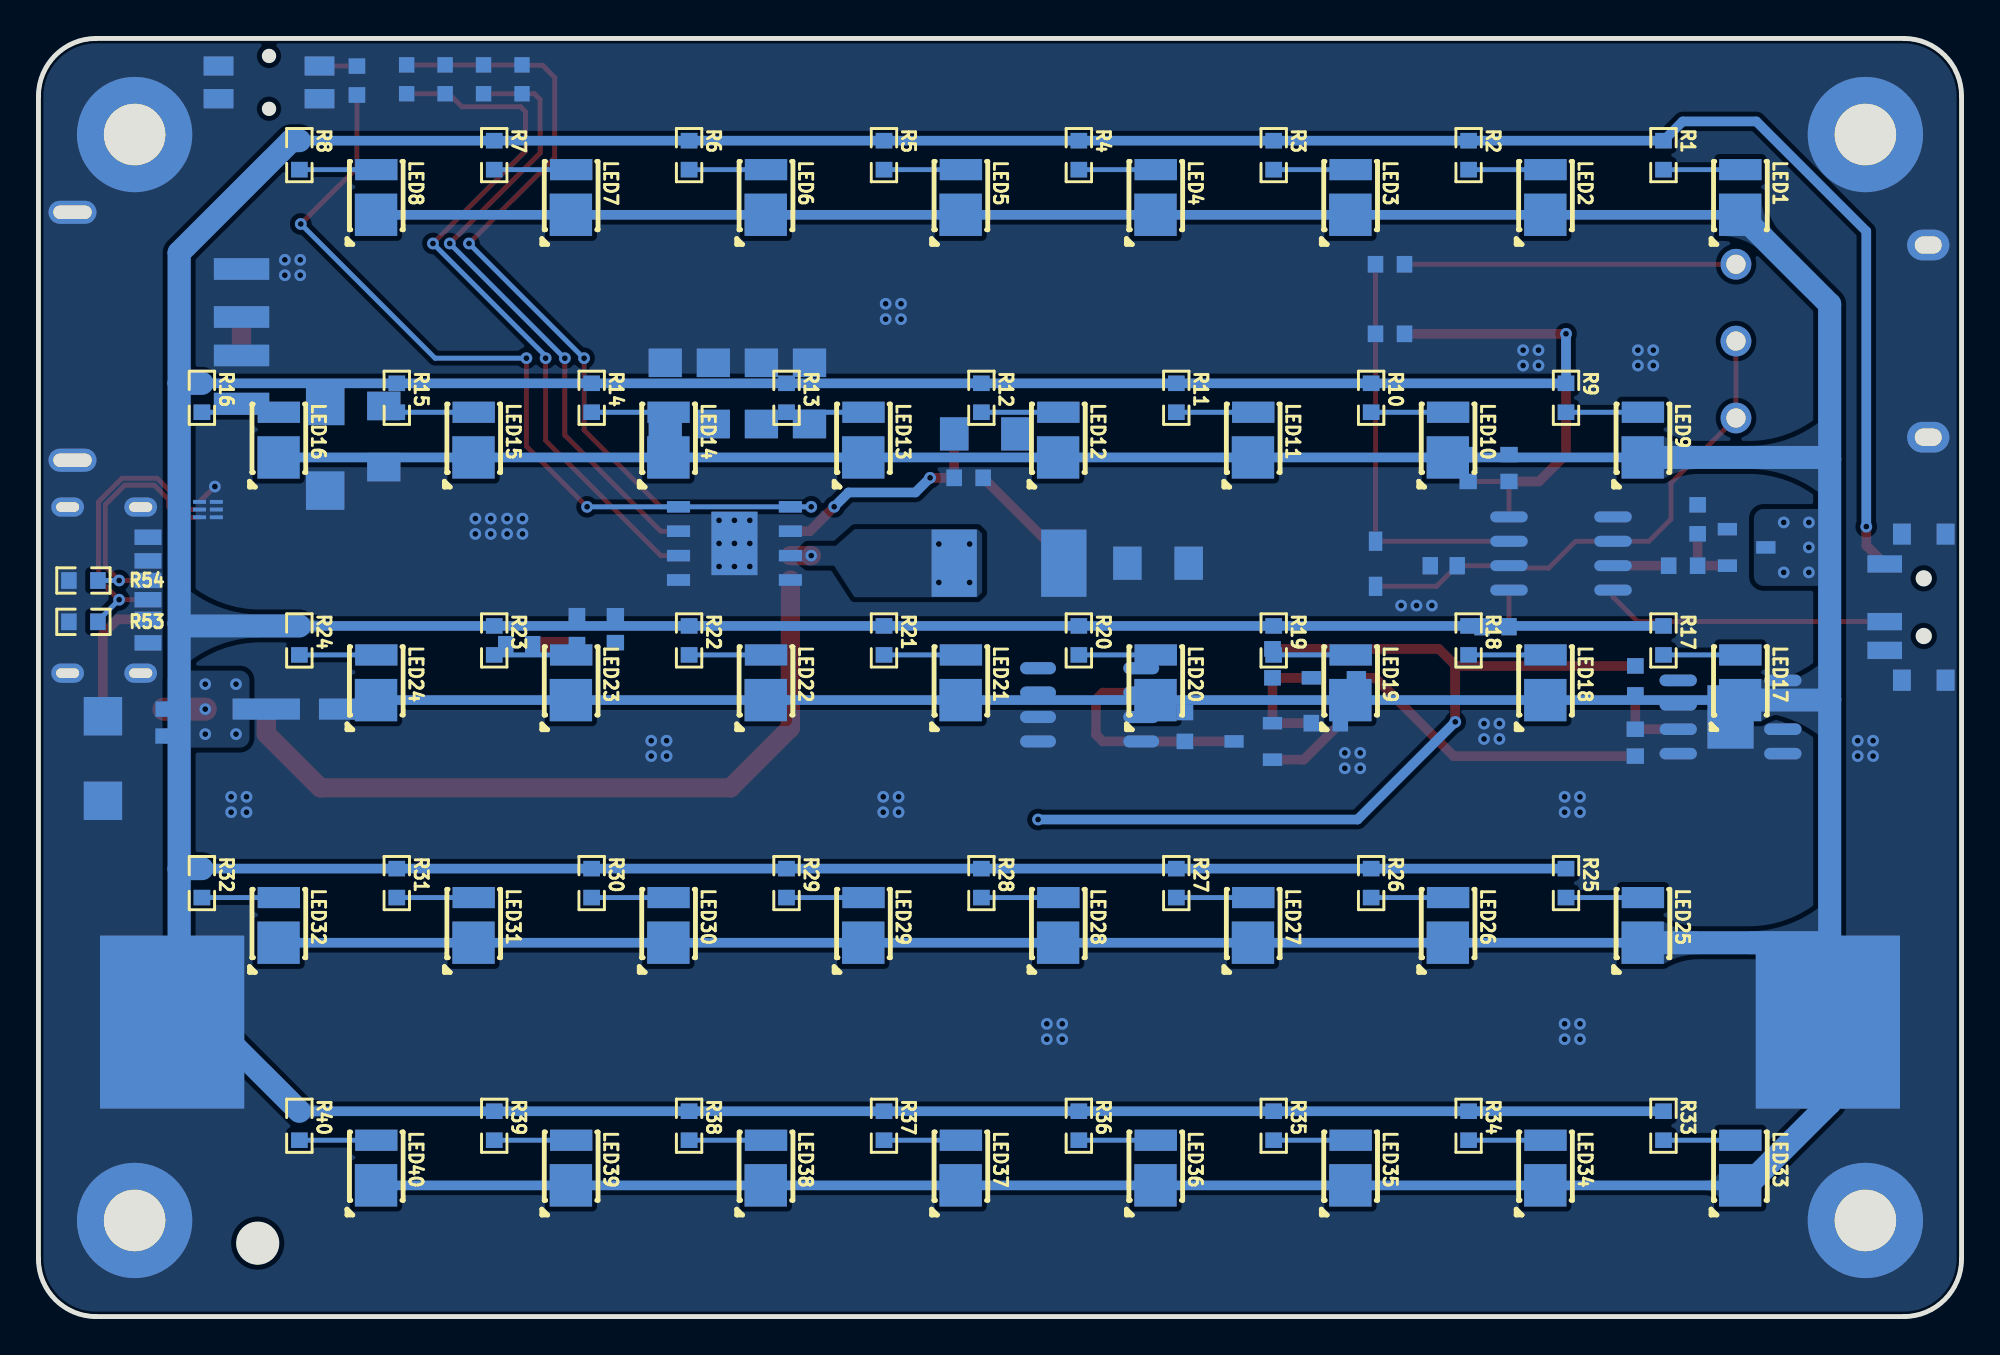
[diagram p5: board, bottom side, seen from below]

Outline 100 x 66.5 mm; copper layers: Top Layer, Bottom Layer. Coordinates in mm from the lower left corner of the outline.
Outline path: 0,63.5 0,3 arc(0.88,0.88) 3,0 97,0 arc(99.12,0.88) 100,3 100,63.5 arc(99.12,65.62) 97,66.5 3,66.5 arc(0.88,65.62) 0,63.5
Stack: Top Layer 0.035mm / Dielectric1 1.51mm FR4 er 4.5 / Bottom Layer 0.035mm

## Design rules (mm)
spacing copperThickness1oz (default): track to track 0.102, other pairs 0.152 to 0.3
spacing copperThickness2oz: track to track 0.203, other pairs 0.152 to 0.3
track width copperThickness1oz (default): min 0.127, default 0.254, max 2.54
track width copperThickness2oz: min 0.203, default 0.254, max 2.54
differential pair differentialPair (default): width min 0.127, default 0.254, max 2.54; gap min 0.152, default 0.152
net GND uses VIN_Solid
net BAT+ uses VIN_Solid
net LED_PWM uses LED_PWM_Solid
net CELL- uses VIN_Solid
net VOUT uses VIN_Solid
net VIN uses LED_5V_Solid
net CELL+ uses VIN_Solid
net $1N352 uses VIN_Solid
net $1N396 uses VIN_Solid

## Placement (name value [footprint] x y rotation side)
BT1  BH-21700-B1BJ001  [BAT-SMD_L82.5.5-W25-BH-21700-B1BJ001]  50 15.32 180 top
C1  22uF  [C1206]  50.79 45.93 180 top
C2  22uF  [C1206]  41.78 39.19 180 top
C3  22uF  [C1206]  59.91 48.03 90 top
C4  22uF  [C1206]  62.41 48.03 90 top
C5  22uF  [C1206]  64.91 48.03 90 top
C6  22uF  [C1206]  67.41 48.03 90 top
C7  10uF  [C0603]  70 35.77 270 top
C8  10uF  [C0603]  75 34.96 0 top
C9  100nF  [C0603]  23.53 44.15 90 top
C10  1uF  [C0603]  25.65 44.15 270 top
C11  10nF  [C0603]  24.23 35.89 0 top
C12  3.9nF  [C0603]  26.92 39.07 0 top
C13  100nF  [C0603]  16.96 29.86 270 top
C14  22uF  [C1206]  82.04 45.79 90 top
C15  1uF  [C0603]  93.47 30.91 270 top
C16  47uF  [CAP-SMD_BD5.0-L5.3-W5.3-LS6.5-FD-1]  85.91 31.6 180 top
D1  1N4148WS  [SOD-323_L1.8-W1.3-LS2.5-RD]  30.47 39.17 90 top
D2  1N4148WS  [SOD-323_L1.8-W1.3-LS2.5-RD]  32.64 33.23 180 top
D3  SMAJ6.0A  [SMA_L4.3-W2.6-LS5.1-RD]  96.65 29.03 270 top
D4  RCLAMP0582N(ES)  [DFN1210-6_L1.2-W1.0-P0.40-BL]  91.19 41.99 90 top
D5  SMAJ6.0A  [SMA_L4.3-W2.6-LS5.1-RD]  85.09 45.18 270 top
L1  CYA0630-1.0UH  [IND-SMD_L7.2-W6.6_GPSR0730]  49.53 39.19 0 top
LED1  -  [RCW_2835_LED_Custom]  11.5 58.5 270 bottom
LED2  -  [RCW_2835_LED_Custom]  21.63 58.5 270 bottom
LED3  -  [RCW_2835_LED_Custom]  31.77 58.5 270 bottom
LED4  -  [RCW_2835_LED_Custom]  41.9 58.5 270 bottom
LED5  -  [RCW_2835_LED_Custom]  52.03 58.5 270 bottom
LED6  -  [RCW_2835_LED_Custom]  62.17 58.5 270 bottom
LED7  -  [RCW_2835_LED_Custom]  72.3 58.5 270 bottom
LED8  -  [RCW_2835_LED_Custom]  82.43 58.5 270 bottom
LED9  -  [RCW_2835_LED_Custom]  16.57 45.88 270 bottom
LED10  -  [RCW_2835_LED_Custom]  26.7 45.88 270 bottom
LED11  -  [RCW_2835_LED_Custom]  36.83 45.88 270 bottom
LED12  -  [RCW_2835_LED_Custom]  46.97 45.88 270 bottom
LED13  -  [RCW_2835_LED_Custom]  57.1 45.88 270 bottom
LED14  -  [RCW_2835_LED_Custom]  67.23 45.88 270 bottom
LED15  -  [RCW_2835_LED_Custom]  77.37 45.88 270 bottom
LED16  -  [RCW_2835_LED_Custom]  87.5 45.88 270 bottom
LED17  -  [RCW_2835_LED_Custom]  11.5 33.25 270 bottom
LED18  -  [RCW_2835_LED_Custom]  21.63 33.25 270 bottom
LED19  -  [RCW_2835_LED_Custom]  31.77 33.25 270 bottom
LED20  -  [RCW_2835_LED_Custom]  41.9 33.25 270 bottom
LED21  -  [RCW_2835_LED_Custom]  52.03 33.25 270 bottom
LED22  -  [RCW_2835_LED_Custom]  62.17 33.25 270 bottom
LED23  -  [RCW_2835_LED_Custom]  72.3 33.25 270 bottom
LED24  -  [RCW_2835_LED_Custom]  82.43 33.25 270 bottom
LED25  -  [RCW_2835_LED_Custom]  16.57 20.62 270 bottom
LED26  -  [RCW_2835_LED_Custom]  26.7 20.62 270 bottom
LED27  -  [RCW_2835_LED_Custom]  36.83 20.62 270 bottom
LED28  -  [RCW_2835_LED_Custom]  46.97 20.62 270 bottom
LED29  -  [RCW_2835_LED_Custom]  57.1 20.62 270 bottom
LED30  -  [RCW_2835_LED_Custom]  67.23 20.62 270 bottom
LED31  -  [RCW_2835_LED_Custom]  77.37 20.62 270 bottom
LED32  -  [RCW_2835_LED_Custom]  87.5 20.62 270 bottom
LED33  -  [RCW_2835_LED_Custom]  11.5 8 270 bottom
LED34  -  [RCW_2835_LED_Custom]  21.63 8 270 bottom
LED35  -  [RCW_2835_LED_Custom]  31.77 8 270 bottom
LED36  -  [RCW_2835_LED_Custom]  41.9 8 270 bottom
LED37  -  [RCW_2835_LED_Custom]  52.03 8 270 bottom
LED38  -  [RCW_2835_LED_Custom]  62.17 8 270 bottom
LED39  -  [RCW_2835_LED_Custom]  72.3 8 270 bottom
LED40  -  [RCW_2835_LED_Custom]  82.43 8 270 bottom
LED41  NCD0603B1  [LED0603-RD]  80.86 64.37 270 top
LED42  NCD0603B1  [LED0603-RD]  78.86 64.37 90 top
LED43  NCD0603B1  [LED0603-RD]  76.86 64.37 270 top
LED44  NCD0603B1  [LED0603-RD]  74.86 64.37 90 top
NOREF  -  [Pad_e219]  5 5 0 top
NOREF#2  -  [Pad_e218]  5 61.5 0 top
NOREF#3  -  [Pad_e221]  95 61.5 0 top
NOREF#4  -  [Pad_e220]  95 5 0 top
Q1  AO3400A  [SOT-23-3_L2.9-W1.3-P1.90-LS2.4-BR]  11.18 40.02 0 top
Q2  IRF7324TR(UMW)  [SOP-8_L4.9-W3.9-P1.27-LS6.0-BL]  45.34 31.83 270 top
Q3  MMBT3904  [SOT-23-3_L2.9-W1.3-P1.90-LS2.4-BR]  36.83 29.92 180 top
R1  180Ω  [R0603]  15.5 60.43 270 bottom
R2  180Ω  [R0603]  25.63 60.43 270 bottom
R3  180Ω  [R0603]  35.77 60.43 270 bottom
R4  180Ω  [R0603]  45.9 60.43 270 bottom
R5  180Ω  [R0603]  56.03 60.43 270 bottom
R6  180Ω  [R0603]  66.17 60.43 270 bottom
R7  180Ω  [R0603]  76.3 60.43 270 bottom
R8  180Ω  [R0603]  86.43 60.43 270 bottom
R9  180Ω  [R0603]  20.57 47.8 270 bottom
R10  180Ω  [R0603]  30.7 47.8 270 bottom
R11  180Ω  [R0603]  40.83 47.8 270 bottom
R12  180Ω  [R0603]  50.97 47.8 270 bottom
R13  180Ω  [R0603]  61.1 47.8 270 bottom
R14  180Ω  [R0603]  71.23 47.8 270 bottom
R15  180Ω  [R0603]  81.37 47.8 270 bottom
R16  180Ω  [R0603]  91.5 47.8 270 bottom
R17  180Ω  [R0603]  15.5 35.18 270 bottom
R18  180Ω  [R0603]  25.63 35.18 270 bottom
R19  180Ω  [R0603]  35.77 35.18 270 bottom
R20  180Ω  [R0603]  45.9 35.18 270 bottom
R21  180Ω  [R0603]  56.03 35.18 270 bottom
R22  180Ω  [R0603]  66.17 35.18 270 bottom
R23  180Ω  [R0603]  76.3 35.18 270 bottom
R24  180Ω  [R0603]  86.43 35.18 270 bottom
R25  180Ω  [R0603]  20.57 22.55 270 bottom
R26  180Ω  [R0603]  30.7 22.55 270 bottom
R27  180Ω  [R0603]  40.83 22.55 270 bottom
R28  180Ω  [R0603]  50.97 22.55 270 bottom
R29  180Ω  [R0603]  61.1 22.55 270 bottom
R30  180Ω  [R0603]  71.23 22.55 270 bottom
R31  180Ω  [R0603]  81.37 22.55 270 bottom
R32  180Ω  [R0603]  91.5 22.55 270 bottom
R33  180Ω  [R0603]  15.5 9.93 270 bottom
R34  180Ω  [R0603]  25.63 9.93 270 bottom
R35  180Ω  [R0603]  35.77 9.93 270 bottom
R36  180Ω  [R0603]  45.9 9.93 270 bottom
R37  180Ω  [R0603]  56.03 9.93 270 bottom
R38  180Ω  [R0603]  66.17 9.93 270 bottom
R39  180Ω  [R0603]  76.3 9.93 270 bottom
R40  180Ω  [R0603]  86.43 9.93 270 bottom
R41  10kΩ  [R0603]  83.44 64.31 90 top
R42  500mΩ  [R0603]  51.63 43.64 0 top
R43  2Ω  [R0603]  72 35.71 270 top
R44  100kΩ  [R0603]  13.72 41.48 90 top
R45  470Ω  [R0603]  14.48 39.07 0 top
R46  2.2kΩ  [R0603]  29.72 51.13 0 top
R47  220Ω  [R0603]  29.72 54.75 0 top
R48  10kΩ  [RISYM_B103_3Pin_Custom]  6.73 50.75 90 top
R49  100kΩ  [R0603]  33.06 30.87 0 top
R50  47kΩ  [R0603]  35.83 33.99 270 top
R51  100kΩ  [R0603]  40.39 30.68 90 top
R52  1kΩ  [R0603]  16.96 33.1 90 top
R53  5.1kΩ  [R0603]  97.66 36.15 0 bottom
R54  5.1kΩ  [R0603]  97.66 38.3 0 bottom
SW1  LCK-TA055-1YL  [KEY-SMD_4P-L4.7-W3.6_LCK-TA055-1YL]  88.01 64.21 180 top
SW2  MK-12C02-G025  [SW-SMD_MK-12C02-G025]  2.41 36.91 270 top
U1  IP5306  [ESOP-8_L4.9-W3.9-P1.27-LS6.0-BL-EP]  63.81 40.23 90 top
U2  TLC555CDR  [SOIC-8_L5.0-W4.0-P1.27-LS6.0-BL]  20.83 39.7 270 top
U3  XB8089D0  [SOIC-8_L4.9-W3.9-P1.27-LS6.0-BL-EP3.3-1]  12.01 31.19 270 top
USB1  TYPE-C 6PIN  [USB-SMD_TYPE-C-6PIN]  96.39 37.8 90 top
USB2  10.0 QHHTZB6.3  [USB-A-TH_10.0QHHTZB6.3]  93.84 51.01 90 top

## Footprints (pads in the part's own frame, mm; a bottom-side part is the same pattern mirrored in y, then rotated)
BAT-SMD_L82.5.5-W25-BH-21700-B1BJ001
  rect 7.5x9 hole 0.001: 1(-43.05,0) 2(43.05,0)
C0603
  rect 0.8x0.9 hole 0.001: 1(-0.7,0) 2(0.7,0)
C1206
  rect 1.485x1.728 hole 0.001: 1(-1.593,0) 2(1.593,0)
CAP-SMD_BD5.0-L5.3-W5.3-LS6.5-FD-1
  rect 3.5x1.1 hole 0.001: 1(-2.245,0) 2(2.245,0)
DFN1210-6_L1.2-W1.0-P0.40-BL
  rect 0.2x0.675 hole 0.001: 1(-0.4,-0.438) 2(0,-0.438) 3(0.4,-0.438) 4(0.4,0.438) 5(0,0.438) 6(-0.4,0.438)
ESOP-8_L4.9-W3.9-P1.27-LS6.0-BL-EP
  rect 0.6x1.2 hole 0.001: 1(-1.905,-2.909) 2(-0.635,-2.909) 3(0.635,-2.909) 4(1.905,-2.909) 5(1.905,2.909) 6(0.635,2.909) 7(-0.635,2.909) 8(-1.905,2.909)
  rect 3.3x2.4 hole 0.001: 9(0,0)
IND-SMD_L7.2-W6.6_GPSR0730
  rect 2.35x3.5 hole 0.001: 1(-2.85,0) 2(2.85,0)
KEY-SMD_4P-L4.7-W3.6_LCK-TA055-1YL
  rect 1.55x1 hole 0.001: 1(-2.625,0.85) 2(2.625,0.85) 3(-2.625,-0.85) 4(2.625,-0.85)
LED0603-RD
  rect 0.8x0.8 hole 0.001: 1(-0.749,0) 2(0.749,0)
Pad_e218
  round 6 hole 3.2: 1(0,0)
Pad_e219
  round 6 hole 3.2: 2(0,0)
Pad_e220
  round 6 hole 3.2: 3(0,0)
Pad_e221
  round 6 hole 3.2: 4(0,0)
R0603
  rect 0.806x0.864 hole 0.001: 1(-0.753,0) 2(0.753,0)
RCW_2835_LED_Custom
  rect 1.1x2.2 hole 0.001: 1(-1.175,0)
  rect 2.2x2.2 hole 0.001: 2(1.175,-0.013)
RISYM_B103_3Pin_Custom
  round 1.6 hole 1: 1(-4,-5) 2(0,-5) 3(4,-5)
  oval 1.6x2.2 hole 0.9x1.4: 4(-5,5) 5(5,5)
SMA_L4.3-W2.6-LS5.1-RD
  rect 2x2 hole 0.001: 1(-2.2,0) 2(2.2,0)
SOD-323_L1.8-W1.3-LS2.5-RD
  rect 1x0.7 hole 0.001: 1(-1.173,0) 2(1.173,0)
SOIC-8_L4.9-W3.9-P1.27-LS6.0-BL-EP3.3-1
  oval 0.602x1.941 hole 0.001: 1(-1.905,-2.72) 2(-0.635,-2.72) 3(0.635,-2.72) 4(1.905,-2.72) 5(1.905,2.72) 6(0.635,2.72) 7(-0.635,2.72) 8(-1.905,2.72)
  rect 3.3x2.4 hole 0.001: 9(0,0)
SOIC-8_L5.0-W4.0-P1.27-LS6.0-BL
  oval 0.569x1.95 hole 0.001: 1(-1.905,-2.705) 2(-0.635,-2.705) 3(0.635,-2.705) 4(1.905,-2.705) 5(1.905,2.705) 6(0.635,2.705) 7(-0.635,2.705) 8(-1.905,2.705)
SOP-8_L4.9-W3.9-P1.27-LS6.0-BL
  oval 0.63x1.865 hole 0.001: 1(-1.905,-2.683) 2(-0.635,-2.683) 3(0.635,-2.683) 4(1.905,-2.683) 5(1.905,2.683) 6(0.635,2.683) 7(-0.635,2.683) 8(-1.905,2.683)
SOT-23-3_L2.9-W1.3-P1.90-LS2.4-BR
  rect 1x0.65 hole 0.001: 1(1,-0.95) 2(1,0.95) 3(-1,0)
SW-SMD_MK-12C02-G025
  rect 0.9x1.8 hole 0.001: 1(-2.25,1.583) 2(0.75,1.583) 3(2.25,1.583)
  rect 1.1x0.93 hole 0.001: 4(3.8,0.686) 5(3.8,-1.583) 6(-3.8,-1.583) 7(-3.8,0.686)
USB-A-TH_10.0QHHTZB6.3
  rect 1.12x2.88 hole 0.001: 1(-3.5,4.395) 2(-1,4.395) 3(1,4.395) 4(3.5,4.395)
  oval 1.2x2.5 hole 0.7x2: 5(-6.45,-4.395) 6(6.45,-4.395)
USB-SMD_TYPE-C-6PIN
  oval 1x1.7 hole 0.5x1.2: 1(-4.32,1.709) 2(4.32,1.709) 3(4.32,-2.091) 4(-4.32,-2.091)
  rect 0.8x1.4 hole 0.001: A5(-0.5,2.087) A9(1.52,2.088) A12(2.75,2.089) B5(0.5,2.087) B9(-1.52,2.091) B12(-2.75,2.089)

## Nets
As in the schematic, except:
GND: C1.2 C2.2 C3.1 C4.1 C5.1 C6.1 C7.2 C8.2 C9.2 C10.1 C11.2 C12.2 C14.1 C15.2 C16.2 D3.2 D4.3 D5.2 NOREF.2 NOREF#2.1 NOREF#3.4 NOREF#4.3 Q1.2 R44.2 R48.4 R48.5 R53.2 R54.2 SW1.1 SW2.3 SW2.4 SW2.5 SW2.6 SW2.7 U1.9 U2.1 U3.1 U3.2 U3.3 U3.4 USB1.1 USB1.2 USB1.3 USB1.4 USB1.A12 USB1.B12 USB2.4 USB2.5 USB2.6
BAT+: C2.1 L1.1 Q2.7 Q2.8 R42.1
CELL+: BT1.1 Q2.5 Q2.6 R50.1 R52.2

Pads without a net: D4 4 5 6; SW1 2 3

## Via types
v1: diameter 0.61, hole 0.305, Top Layer to Bottom Layer, 106 vias

## Routing (per net, layer and track width the routed paths; a pad name or vN(x,y) marks a point on that pad's centre or on a via; arc(x,y) is an arc through that point)
GND: length 1.1
  Top Layer w0.254: 91.62,42.39 v1(90.83,43.19)
  vias: v1(4.6,29.96) v1(4.6,29.16) v1(5.4,29.96) v1(5.4,29.16) v1(16.03,50.28) v1(16.03,49.48) v1(16.83,50.28) v1(16.83,49.48) v1(19.84,27.04) v1(19.84,26.24) v1(19.84,15.23) v1(19.84,14.43) v1(20.64,27.04) v1(20.64,26.24) v1(20.64,15.23) v1(20.64,14.43) v1(22,50.28) v1(22,49.48) v1(22.8,50.28) v1(22.8,49.48) v1(24.03,30.85) v1(24.03,30.05) v1(24.83,30.85) v1(24.83,30.05) v1(27.54,36.99) v1(28.34,36.99) v1(29.14,36.99) v1(31.27,29.33) v1(31.27,28.53) v1(32.07,29.33) v1(32.07,28.53) v1(46.76,15.23) v1(46.76,14.43) v1(47.56,15.23) v1(47.56,14.43) v1(55.15,52.69) v1(55.15,51.89) v1(55.27,27.04) v1(55.27,26.24) v1(55.95,52.69) v1(55.95,51.89) v1(56.07,27.04) v1(56.07,26.24) v1(63.01,41.43) v1(63.01,40.23) v1(63.01,39.03) v1(63.81,41.43) v1(63.81,40.23) v1(63.81,39.03) v1(64.61,41.43) v1(64.61,40.23) v1(64.61,39.03) v1(67.34,29.96) v1(67.34,29.16) v1(68.14,29.96) v1(68.14,29.16) v1(74.83,41.52) v1(74.83,40.72) v1(75.63,41.52) v1(75.63,40.72) v1(76.48,41.52) v1(76.48,40.72) v1(77.28,41.52) v1(77.28,40.72) v1(86.39,54.98) v1(86.39,54.18) v1(87.19,54.98) v1(87.19,54.18) v1(89.18,27.04) v1(89.18,26.24) v1(89.98,27.04) v1(89.98,26.24)
VIN: length 6.9
  Top Layer w0.5: D3.1 96.65,35.52 95.88,36.28 USB1.B9
BAT+: length 6.2
  Top Layer w0.5: 50.87,43.64 46.68,39.45 L1.1
CC1: length 15.3
  Top Layer w0.254: USB1.A5 v1(95.81,37.3) 96.88,38.37 96.88,42.39 95.66,43.61 93.83,43.61 92.86,42.64 92.86,42.27 92.58,41.99 D4.2
  Bottom Layer w0.254: R53.1 96.91,36.19 v1(95.81,37.3)
CC2: length 13.1
  Top Layer w0.254: D4.1 92.69,41.59 93.22,42.12 93.22,42.5 93.98,43.26 95.51,43.26 96.52,42.25 96.52,39.01 v1(95.81,38.3) USB1.B5
  Bottom Layer w0.254: v1(95.81,38.3) R54.1
CELL+: length 46
  Top Layer w0.5: R50.1 27.18,34.74 26.33,33.88 ; 26.33,33.88 26.3,33.85 16.96,33.85 ; 26.33,33.88 v1(26.33,30.94)
  Bottom Layer w0.5: v1(48.02,25.86) 31.41,25.86 v1(26.33,30.94)
CELL-: length 23.2
  Top Layer w0.5: 16.96,29.16 26.41,29.16 30.49,33.23 D2.2 31.47,31.71 R49.1 34.2,28.97 Q3.2
LED1: length 37.5
  Top Layer w0.254: U1.2 67.64,39.59 73.63,45.58 v1(73.63,49.86) ; LED41.2 LED42.1 78.66,63.62 77.98,62.94 74.93,62.94 74.68,62.69 74.68,60.64 v1(79.49,55.83)
  Bottom Layer w0.254: v1(73.63,49.86) 73.63,49.97 v1(79.49,55.83)
LED2: length 33
  Top Layer w0.254: v1(78.61,55.83) 73.91,60.53 73.91,63.33 74.21,63.62 LED44.1 LED43.2 ; U1.3 67.64,40.86 72.63,45.85 v1(72.63,49.86)
  Bottom Layer w0.254: v1(72.63,49.86) 72.64,49.86 v1(78.61,55.83)
LED3: length 37.2
  Top Layer w0.254: U1.4 67.64,42.13 71.63,46.12 v1(71.63,49.86) ; LED41.1 LED42.2 LED43.1 LED44.2 74.84,65.1 73.79,65.1 73.15,64.47 73.15,60.29 v1(77.61,55.83)
  Bottom Layer w0.254: v1(71.63,49.86) 71.64,49.86 v1(77.61,55.83)
LED_PWM: length 433.4
  Bottom Layer w0.5: LED17.2 LED18.2 LED19.2 LED20.2 LED21.2 LED22.2 LED24.2 ; LED8.2 LED6.2 LED5.2 LED4.2 LED3.2 LED2.2 LED1.2 ; LED16.2 LED15.2 LED14.2 LED13.2 LED12.2 LED11.2 LED9.2 ; LED32.2 LED31.2 LED30.2 LED29.2 LED28.2 LED27.2 LED25.2 ; LED33.2 LED34.2 LED35.2 LED36.2 LED37.2 LED38.2 LED40.2
  Bottom Layer w1.2: 6.86,19.34 6.86,11.1 11.14,6.82 LED33.2 ; 6.86,19.34 6.96,19.45 LED25.2 ; 6.86,19.34 6.86,32.1 ; LED1.2 6.86,52.67 6.86,44.61 ; 6.86,44.61 6.86,32.1 ; 6.86,44.61 6.95,44.7 LED9.2 ; 6.86,32.1 6.88,32.08 LED17.2
  vias: v1(7.94,41.32) v1(7.94,40.02) v1(7.94,38.72) v1(9.25,41.32) v1(9.25,38.72)
PWM_CT: length 27.6
  Top Layer w0.254: R48.2 R48.1 15.11,43.37 15.11,41.48 16.26,40.34 U2.2 20.07,40.34 21.46,38.94 23.41,38.94 U2.6 C12.1 27.3,37.99 D1.1
VOUT: length 515.9
  Top Layer w0.254: C10.2 C9.1 U2.8
  Top Layer w0.5: v1(4.95,41.1) 4.95,40.12 SW2.1 ; R46.1 v1(20.57,51.13) 20.57,44.85 21.97,43.45 C9.1
  Top Layer w1: U1.8 60.9,30.62 64.01,27.51 85.34,27.51 88.16,30.32 C16.1
  Top Layer w1.2: C15.1 v1(91.33,31.61)
  Bottom Layer w0.5: 20.57,23.31 91.5,23.31 ; v1(20.57,51.13) R9.1 R10.1 R11.1 R12.1 R13.1 R14.1 R15.1 R16.1 ; R24.1 R23.1 R22.1 R21.1 R20.1 R19.1 R18.1 R17.1 ; R8.1 R7.1 R6.1 R5.1 R4.1 R3.1 R2.1 R1.1 14.5,62.18 10.67,62.18 4.95,56.47 v1(4.95,41.1) ; R33.1 R34.1 R35.1 R36.1 R37.1 R38.1 R39.1 R40.1
  Bottom Layer w1.2: 92.68,23.3 92.68,16.93 R40.1 ; 92.68,23.3 92.68,23.31 91.5,23.31 ; 92.68,23.3 92.68,36.06 ; 92.68,48.55 92.68,48.56 R16.1 ; 92.68,48.55 92.68,36.06 ; 92.68,48.55 92.68,55.35 86.85,61.18 R8.1 ; 92.68,36.06 92.55,35.93 R24.1
  vias: v1(89.73,32.91) v1(89.73,30.31) v1(91.33,32.91) v1(91.33,30.31)
$1N266: length 3.2
  Top Layer w0.5: R44.1 R45.1 Q1.1
$1N267: length 2.9
  Top Layer w0.5: R45.2 U2.3
$1N268: length 15
  Top Layer w0.254: U2.4 18.12,37.44 16.84,36.16 SW2.2
$1N269: length 1.9
  Top Layer w0.254: C11.1 U2.5
$1N271: length 21.4
  Top Layer w0.254: R47.2 R46.2 30.47,40.34 ; D1.2 23.53,40.34
$1N327: length 1.9
  Top Layer w0.254: SW1.4 R41.2
$1N347: length 4
  Top Layer w0.5: R52.1 C13.1 U3.6
$1N352: length 1.1
  Top Layer w1: U1.7 v1(59.82,39.59)
  vias: v1(51.58,40.19) v1(51.58,38.19) v1(53.18,40.19) v1(53.18,38.19)
$1N382: length 2.3
  Top Layer w0.8: R43.2 C8.1
$1N397: length 11.7
  Top Layer w0.5: Q2.2 44.66,32.46 45.01,32.11 45.01,30.28 44.66,29.92 Q2.4 R51.1 Q3.3
$1N402: length 6.4
  Top Layer w0.5: R49.2 Q3.1 R50.2 33.81,33.23
$1N415: length 44.3
  Top Layer w0.254: R41.1 83.44,59.77 v1(86.36,56.85) ; v1(71.47,42.13) 74.63,45.29 v1(74.63,49.86) ; U1.5 v1(59.82,42.13)
  Bottom Layer w0.254: v1(86.36,56.85) 79.38,49.86 v1(74.63,49.86) ; v1(71.47,42.13) 59.82,42.13
$1N424: length 12
  Top Layer w0.5: v1(53.64,43.64) R42.2 C1.1 ; v1(58.62,42.13) 59.89,40.86 U1.6
  Bottom Layer w0.5: v1(58.62,42.13) 57.88,42.88 54.4,42.88 v1(53.64,43.64)
$1N445: length 17.2
  Top Layer w0.254: R48.3 R47.1
$1N449: length 2
  Top Layer w1: USB2.3 USB2.2
$2N433: length 4
  Bottom Layer w0.254: LED1.1 R1.2
$2N435: length 4
  Bottom Layer w0.254: LED2.1 R2.2
$2N437: length 4
  Bottom Layer w0.254: LED3.1 R3.2
$2N439: length 4
  Bottom Layer w0.254: LED4.1 R4.2
$2N441: length 4
  Bottom Layer w0.254: LED5.1 R5.2
$2N443: length 4
  Bottom Layer w0.254: LED6.1 R6.2
$2N445: length 4
  Bottom Layer w0.254: LED7.1 R7.2
$2N447: length 4
  Bottom Layer w0.254: LED8.1 R8.2
$2N449: length 4
  Bottom Layer w0.254: R9.2 LED9.1
$2N451: length 4
  Bottom Layer w0.254: R10.2 LED10.1
$2N453: length 4
  Bottom Layer w0.254: R11.2 LED11.1
$2N455: length 4
  Bottom Layer w0.254: R12.2 LED12.1
$2N457: length 4
  Bottom Layer w0.254: R13.2 LED13.1
$2N459: length 4
  Bottom Layer w0.254: R14.2 LED14.1
$2N461: length 4
  Bottom Layer w0.254: LED15.1 R15.2
$2N463: length 4
  Bottom Layer w0.254: LED16.1 R16.2
$2N465: length 4
  Bottom Layer w0.254: LED17.1 R17.2
$2N467: length 4
  Bottom Layer w0.254: LED18.1 R18.2
$2N469: length 4
  Bottom Layer w0.254: LED19.1 R19.2
$2N471: length 4
  Bottom Layer w0.254: LED20.1 R20.2
$2N473: length 4
  Bottom Layer w0.254: LED21.1 R21.2
$2N475: length 4
  Bottom Layer w0.254: LED22.1 R22.2
$2N477: length 4
  Bottom Layer w0.254: LED23.1 R23.2
$2N479: length 4
  Bottom Layer w0.254: LED24.1 R24.2
$2N481: length 4
  Bottom Layer w0.254: R25.2 LED25.1
$2N483: length 4
  Bottom Layer w0.254: R26.2 LED26.1
$2N485: length 4
  Bottom Layer w0.254: R27.2 LED27.1
$2N487: length 4
  Bottom Layer w0.254: R28.2 LED28.1
$2N489: length 4
  Bottom Layer w0.254: R29.2 LED29.1
$2N491: length 4
  Bottom Layer w0.254: R30.2 LED30.1
$2N493: length 4
  Bottom Layer w0.254: R31.2 LED31.1
$2N495: length 4
  Bottom Layer w0.254: R32.2 LED32.1
$2N497: length 4
  Bottom Layer w0.254: LED33.1 R33.2
$2N499: length 4
  Bottom Layer w0.254: LED34.1 R34.2
$2N501: length 4
  Bottom Layer w0.254: LED35.1 R35.2
$2N503: length 4
  Bottom Layer w0.254: LED36.1 R36.2
$2N505: length 4
  Bottom Layer w0.254: LED37.1 R37.2
$2N507: length 4
  Bottom Layer w0.254: LED38.1 R38.2
$2N509: length 4
  Bottom Layer w0.254: LED39.1 R39.2
$2N511: length 4
  Bottom Layer w0.254: LED40.1 R40.2

## Copper pours and planes (outline as drawn; the poured copper is in the pictures)
GND on Top Layer: -0.38,66.88 100.33,66.88 100.33,-0.43 -0.38,-0.43
GND on Bottom Layer: -0.38,66.88 100.33,66.88 100.33,-0.43 -0.38,-0.43
VIN on Top Layer: 66.11,38.66 67.66,38.66 68.84,39.83 95,39.7 95,38.94 93.34,38.94 92.99,38.59 93,36.99 93.34,36.66 95,36.66 95,35.91 67.75,35.93 66.11,37.56
BAT+ on Top Layer: 46.92,31.95 46.43,32.44 46.43,35.15 45.43,36.15 43.81,36.15 42.16,37.8 42.16,40.97 43.82,42.62 48.23,42.62 49.53,41.32 49.53,37.24 50.42,36.35 50.42,32.8 49.57,31.95
CELL+ on Top Layer: 97.03,20.14 98.43,18.75 98.42,12.09 97.03,10.7 55.37,10.75 46.86,19.26 46.86,28.78 46.35,29.29 46.35,31.19 46.74,31.58 51.44,31.58 54.23,28.78 54.23,24.59 58.67,20.14
CELL- on Top Layer: 1.88,10.9 1.83,27.06 3.03,28.26 10.11,28.26 10.54,28.68 10.54,33.47 10.8,33.73 15.75,33.73 16.02,33.47 16.03,31.64 15.74,31.36 13.88,31.36 13.54,31.01 13.54,30.1 13.89,29.74 15.85,29.74 16.03,29.56 18.15,29.56 18.29,29.42 18.29,11.37 16.71,9.79 2.99,9.79
LED_PWM on Top Layer: 7.24,41.52 7.25,41.62 7.3,41.76 7.39,41.87 7.5,41.96 7.63,42.01 7.74,42.02 10.3,42.02 10.4,42.01 10.53,41.96 10.65,41.87 10.73,41.76 10.78,41.62 10.8,41.52 10.8,38.52 10.78,38.41 10.73,38.28 10.65,38.16 10.53,38.08 10.4,38.03 10.3,38.02 7.74,38.02 7.63,38.03 7.5,38.08 7.39,38.16 7.3,38.28 7.25,38.41 7.24,38.52
LED_PWM on Bottom Layer: 6.86,41.52 6.87,41.62 6.92,41.76 7,41.87 7.12,41.96 7.25,42.01 7.36,42.02 10.3,42.02 10.4,42.01 10.53,41.96 10.65,41.87 10.73,41.76 10.78,41.62 10.8,41.52 10.8,38.52 10.78,38.41 10.73,38.28 10.65,38.16 10.53,38.08 10.4,38.03 10.3,38.02 7.36,38.02 7.25,38.03 7.12,38.08 7,38.16 6.92,38.28 6.87,38.41 6.86,38.52
VOUT on Top Layer: 86.36,33.11 86.37,33.21 86.42,33.34 86.51,33.46 86.62,33.54 86.75,33.59 86.86,33.61 91.53,33.61 91.63,33.59 91.77,33.54 91.88,33.46 91.97,33.34 92.02,33.21 92.03,33.11 92.03,30.11 92.02,30 91.97,29.87 91.88,29.75 91.77,29.67 91.63,29.62 91.53,29.61 86.86,29.61 86.75,29.62 86.62,29.67 86.51,29.75 86.42,29.87 86.37,30 86.36,30.11
VOUT on Top Layer: 90.88,46.95 87.65,46.95 86.83,46.12 80.81,46.11 80.01,46.92 80.01,48.59 77.6,51.01 71.12,51.01 68.4,48.29 58.78,48.29 57.81,47.31 57.8,40.46 59.62,38.62 61.51,38.62 61.5,37.25 61.12,36.87 57.97,36.87 54.52,40.32 54.52,47.88 59.42,52.78 69.09,52.78 70.99,54.69 81.04,54.67 87.65,48.06 90.88,48.07
VOUT on Bottom Layer: 89.03,33.11 89.04,33.21 89.09,33.34 89.17,33.46 89.29,33.54 89.42,33.59 89.53,33.61 92.8,33.61 92.9,33.59 93.04,33.54 93.15,33.46 93.24,33.34 93.29,33.21 93.3,33.11 93.3,30.11 93.29,30 93.24,29.87 93.15,29.75 93.04,29.67 92.9,29.62 92.8,29.61 89.53,29.61 89.42,29.62 89.29,29.67 89.17,29.75 89.09,29.87 89.04,30 89.03,30.11
$1N352 on Bottom Layer: 60.01,40.11 60.33,39.79 60.32,39.32 60.01,39.07 58.63,39.07 57.57,37.43 51.18,37.43 50.93,37.68 50.93,40.74 51.16,40.97 57.55,40.97 58.53,40.11
$1N396 on Top Layer: 43.43,30.65 39.29,30.66 38.98,30.96 38.98,33.85 39.29,34.16 43.44,34.16 43.68,33.92 43.68,33.35 43.44,33.11 41.75,33.11 41.44,32.79 41.44,32.17 41.74,31.87 43.44,31.85 43.68,31.61 43.68,30.9

Small or netless copper shapes (teardrops, artwork), in the pictures only: 3 on Top Layer, 11 on Bottom Layer

## Text on the board
Top Silkscreen Layer: ON | OFF | LIGHT | BRIGHTNESS | POWER | USB-A | USB-C | BACKLIT PCB ART LAMP / Designed by Junyi Wu / 2026/09/15 / REV: 2.3 | 1x21700 LI-ION BATTERY 3.6/3.7V | - | +
